# Altium project Metlino.PrjPcb (part 12 of 13)

## Sheet MCH_FPGA_Banks_66_68_HP_FMC.SchDoc: Metlino
size 420 x 297 mm; CheckedBy: P.Kulik,T.Przywozki,W.Ruclo; Author: G.Kasprowicz; CompanyName: WUT ISE; DrawnBy: G.Kasprowicz; Organization: WUT ISE; Address1: PW ISE; Address2: Nowowiejska 15/19 00-665 Warsaw; Address3: gkasprow@gmail.com; DocumentNumber: 5; Revision: 2; SheetNumber: 5; SheetTotal: 29; ModifiedBy: -; CheckedDate: -; Title2: FPGA banks - FMC; DivGrp: WUT ISE; Designer: G.Kasprowicz; ModifiedDate: -; ProjectName: Sensor Box
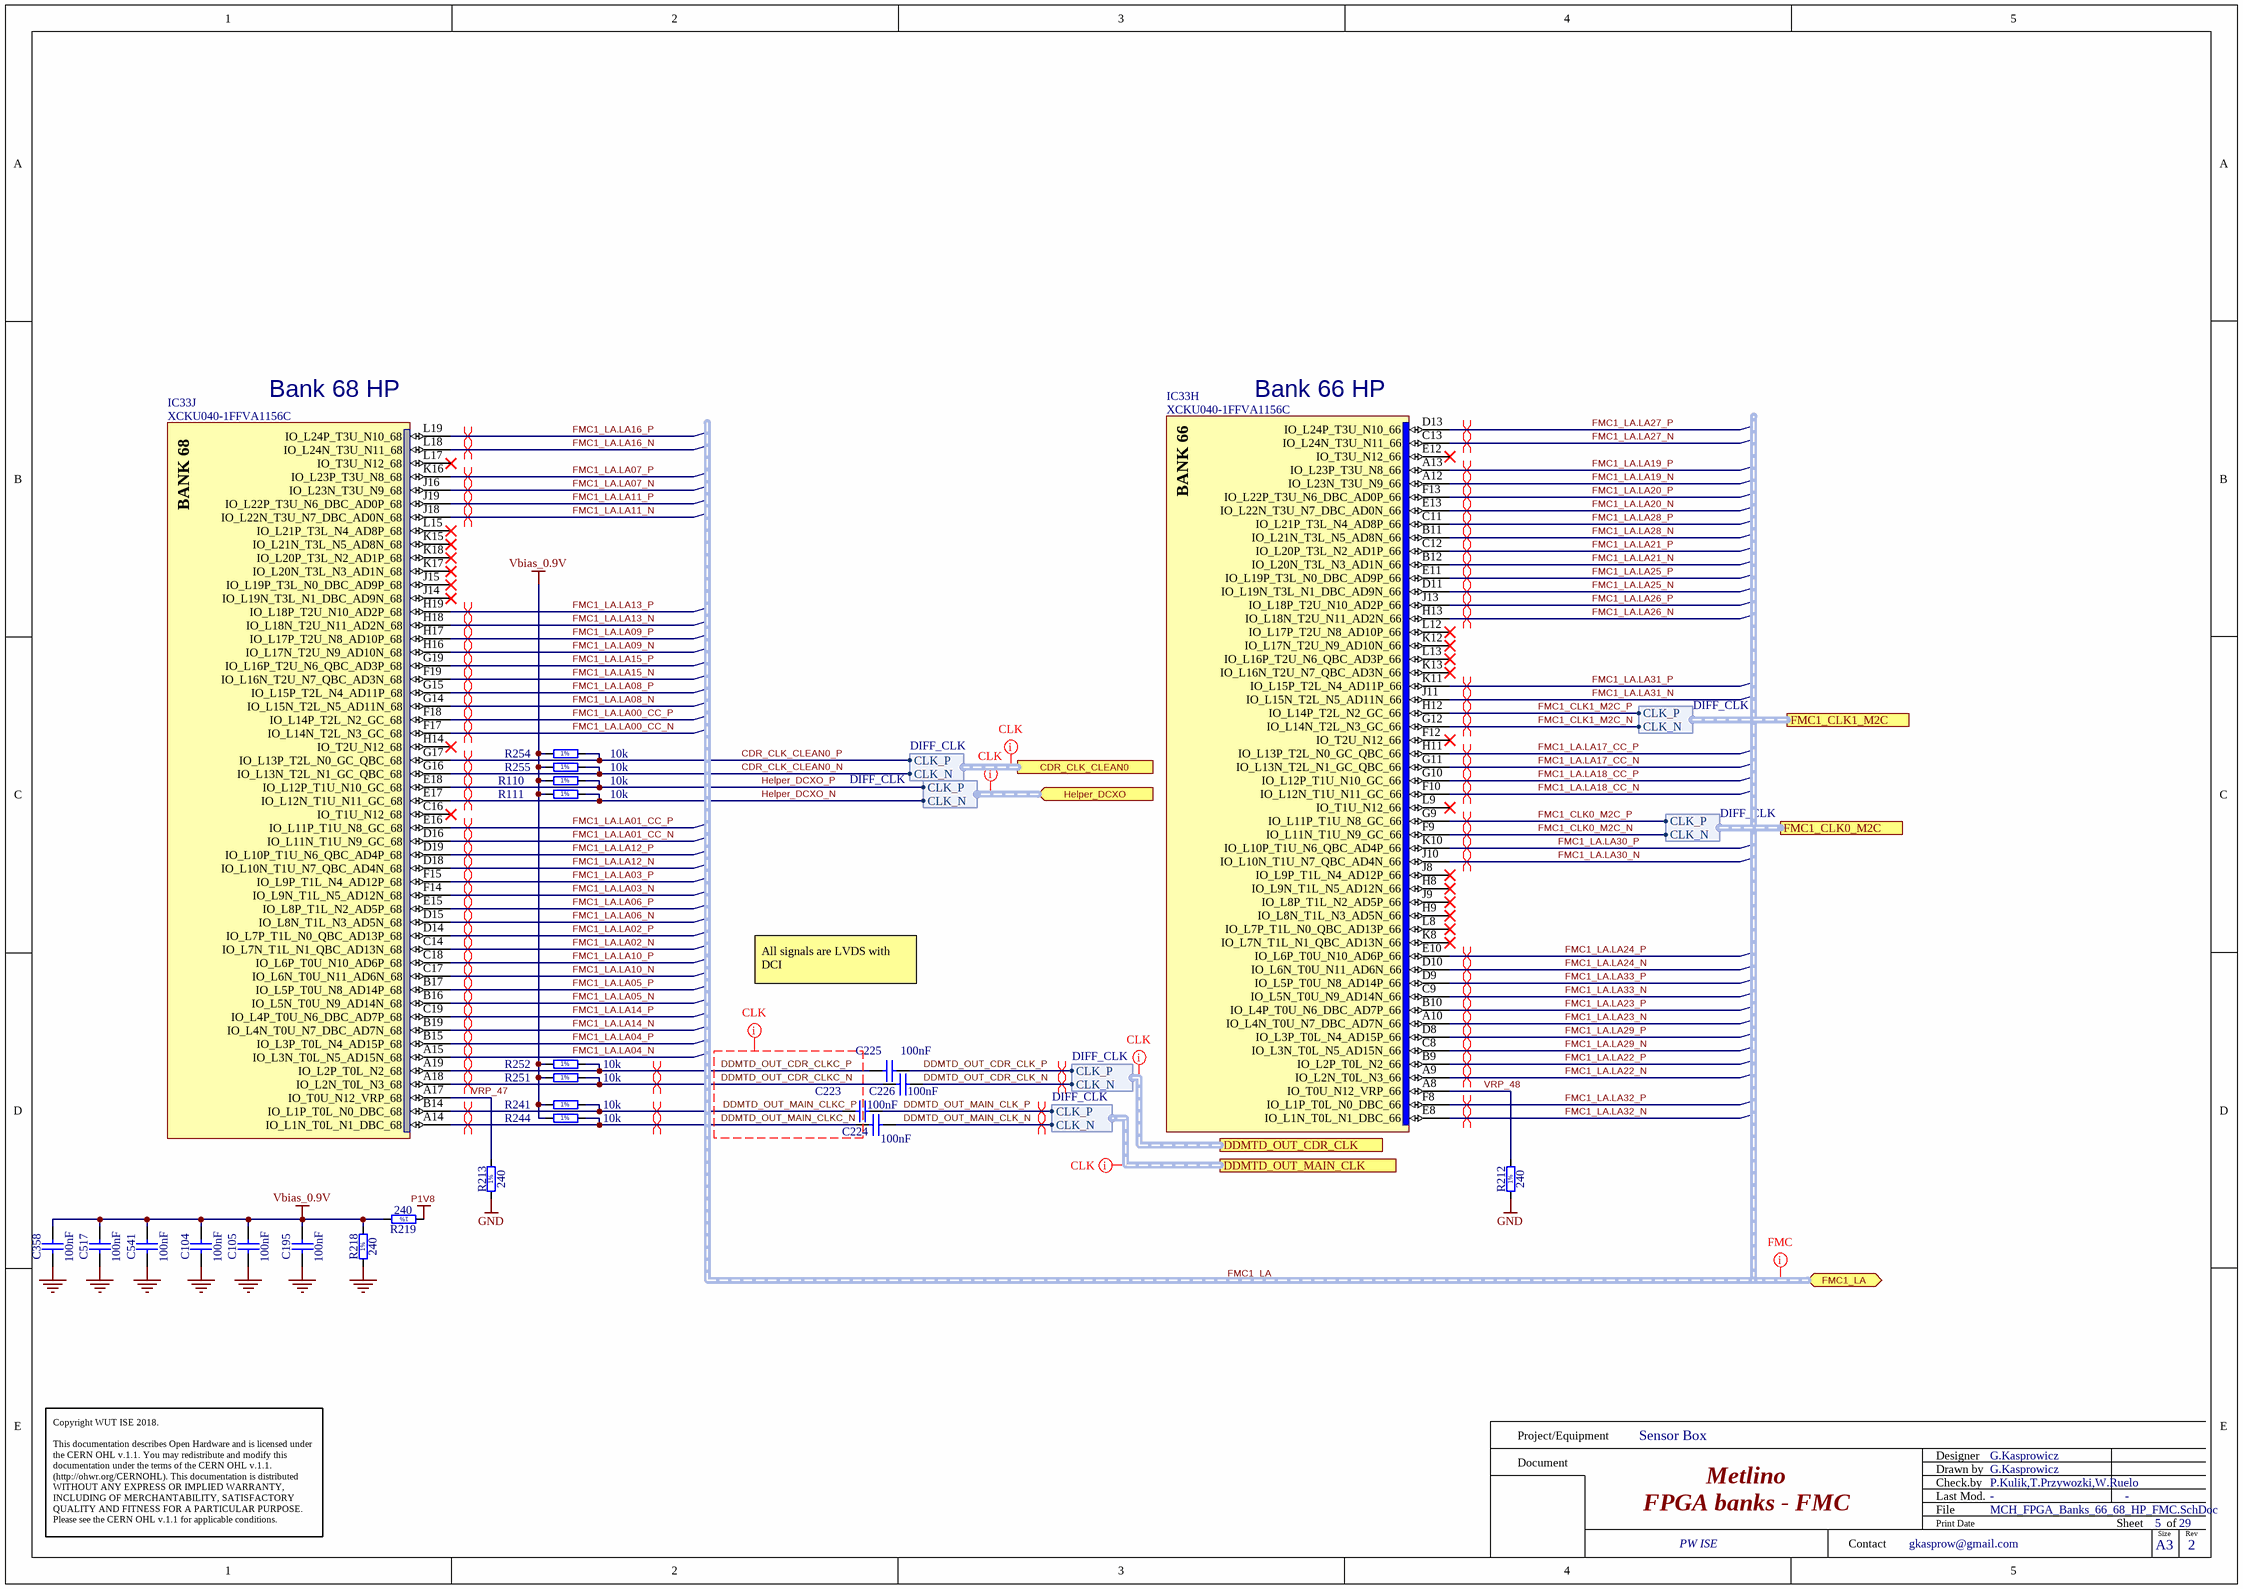
[diagram p25: MCH_FPGA_Banks_66_68_HP_FMC.SchDoc]

### Parts
C104  100nF  [CAPC0603X33N]
C105  100nF  [CAPC0603X33N]
C195  100nF  [CAPC0603X33N]
C223  100nF  [CAPC0603X33N]
C224  100nF  [CAPC0603X33N]
C225  100nF  [CAPC0603X33N]
C226  100nF  [CAPC0603X33N]
C358  100nF  [CAPC0603X33N]
C517  100nF  [CAPC0603X33N]
C541  100nF  [CAPC0603X33N]
IC33  XCKU040-1FFVA1156C  [BGA1156C100P34X34_3500X3500X350]  (parts H,J of 22)
R110  10k  [RESC1005X40N]
R111  10k  [RESC1005X40N]
R212  240  [RESC1005X40N]
R213  240  [RESC1005X40N]
R218  240  [RESC1005X40N]
R219  240  [RESC1005X40N]
R241  10k  [RESC1005X40N]
R244  10k  [RESC1005X40N]
R251  10k  [RESC1005X40N]
R252  10k  [RESC1005X40N]
R254  10k  [RESC1005X40N]
R255  10k  [RESC1005X40N]

### Ports
CDR_CLK_CLEAN0 (harness DIFF_CLK), DDMTD_OUT_CDR_CLK (harness DIFF_CLK), DDMTD_OUT_MAIN_CLK (harness DIFF_CLK), FMC1_CLK0_M2C (harness DIFF_CLK), FMC1_CLK1_M2C (harness DIFF_CLK), FMC1_LA (bidir, harness FMC_LA), Helper_DCXO (in, harness DIFF_CLK)

### Harnesses
DIFF_CLK: CLK_N, CLK_P

### Nets
GND: C104.2 C105.2 C195.2 C358.2 C517.2 C541.2 R212.1 R213.1 R218.1
P1V8: R219.1
Vbias_0.9V: C104.1 C105.1 C195.1 C358.1 C517.1 C541.1 R110.1 R111.1 R218.2 R219.2 R241.1 R244.1 R251.1 R252.1 R254.1 R255.1
CDR_CLK_CLEAN0_N: IC33.G16(IO_L13N_T2L_N1_GC_QBC_68) R255.2 ; port CDR_CLK_CLEAN0.CLK_N
CDR_CLK_CLEAN0_P: IC33.G17(IO_L13P_T2L_N0_GC_QBC_68) R254.2 ; port CDR_CLK_CLEAN0.CLK_P
DDMTD_OUT_CDR_CLK_N: C226.2 ; port DDMTD_OUT_CDR_CLK.CLK_N
DDMTD_OUT_CDR_CLK_P: C225.2 ; port DDMTD_OUT_CDR_CLK.CLK_P
DDMTD_OUT_CDR_CLKC_N: C226.1 IC33.A18(IO_L2N_T0L_N3_68) R251.2
DDMTD_OUT_CDR_CLKC_P: C225.1 IC33.A19(IO_L2P_T0L_N2_68) R252.2
DDMTD_OUT_MAIN_CLK_N: C224.2 ; port DDMTD_OUT_MAIN_CLK.CLK_N
DDMTD_OUT_MAIN_CLK_P: C223.2 ; port DDMTD_OUT_MAIN_CLK.CLK_P
DDMTD_OUT_MAIN_CLKC_N: C224.1 IC33.A14(IO_L1N_T0L_N1_DBC_68) R244.2
DDMTD_OUT_MAIN_CLKC_P: C223.1 IC33.B14(IO_L1P_T0L_N0_DBC_68) R241.2
FMC1_CLK0_M2C_N: IC33.F9(IO_L11N_T1U_N9_GC_66) ; port FMC1_CLK0_M2C.CLK_N  [project net CLK0_M2C_N]
FMC1_CLK0_M2C_P: IC33.G9(IO_L11P_T1U_N8_GC_66) ; port FMC1_CLK0_M2C.CLK_P  [project net CLK0_M2C_P]
FMC1_CLK1_M2C_N: IC33.G12(IO_L14N_T2L_N3_GC_66) ; port FMC1_CLK1_M2C.CLK_N  [project net CLK1_M2C_N]
FMC1_CLK1_M2C_P: IC33.H12(IO_L14P_T2L_N2_GC_66) ; port FMC1_CLK1_M2C.CLK_P  [project net CLK1_M2C_P]
FMC1_LA.LA00_CC_N: IC33.F17(IO_L14N_T2L_N3_GC_68)
FMC1_LA.LA00_CC_P: IC33.F18(IO_L14P_T2L_N2_GC_68)
FMC1_LA.LA01_CC_N: IC33.D16(IO_L11N_T1U_N9_GC_68)
FMC1_LA.LA01_CC_P: IC33.E16(IO_L11P_T1U_N8_GC_68)
FMC1_LA.LA02_N: IC33.C14(IO_L7N_T1L_N1_QBC_AD13N_68)
FMC1_LA.LA02_P: IC33.D14(IO_L7P_T1L_N0_QBC_AD13P_68)
FMC1_LA.LA03_N: IC33.F14(IO_L9N_T1L_N5_AD12N_68)
FMC1_LA.LA03_P: IC33.F15(IO_L9P_T1L_N4_AD12P_68)
FMC1_LA.LA04_N: IC33.A15(IO_L3N_T0L_N5_AD15N_68)
FMC1_LA.LA04_P: IC33.B15(IO_L3P_T0L_N4_AD15P_68)
FMC1_LA.LA05_N: IC33.B16(IO_L5N_T0U_N9_AD14N_68)
FMC1_LA.LA05_P: IC33.B17(IO_L5P_T0U_N8_AD14P_68)
FMC1_LA.LA06_N: IC33.D15(IO_L8N_T1L_N3_AD5N_68)
FMC1_LA.LA06_P: IC33.E15(IO_L8P_T1L_N2_AD5P_68)
FMC1_LA.LA07_N: IC33.J16(IO_L23N_T3U_N9_68)
FMC1_LA.LA07_P: IC33.K16(IO_L23P_T3U_N8_68)
FMC1_LA.LA08_N: IC33.G14(IO_L15N_T2L_N5_AD11N_68)
FMC1_LA.LA08_P: IC33.G15(IO_L15P_T2L_N4_AD11P_68)
FMC1_LA.LA09_N: IC33.H16(IO_L17N_T2U_N9_AD10N_68)
FMC1_LA.LA09_P: IC33.H17(IO_L17P_T2U_N8_AD10P_68)
FMC1_LA.LA10_N: IC33.C17(IO_L6N_T0U_N11_AD6N_68)
FMC1_LA.LA10_P: IC33.C18(IO_L6P_T0U_N10_AD6P_68)
FMC1_LA.LA11_N: IC33.J18(IO_L22N_T3U_N7_DBC_AD0N_68)
FMC1_LA.LA11_P: IC33.J19(IO_L22P_T3U_N6_DBC_AD0P_68)
FMC1_LA.LA12_N: IC33.D18(IO_L10N_T1U_N7_QBC_AD4N_68)
FMC1_LA.LA12_P: IC33.D19(IO_L10P_T1U_N6_QBC_AD4P_68)
FMC1_LA.LA13_N: IC33.H18(IO_L18N_T2U_N11_AD2N_68)
FMC1_LA.LA13_P: IC33.H19(IO_L18P_T2U_N10_AD2P_68)
FMC1_LA.LA14_N: IC33.B19(IO_L4N_T0U_N7_DBC_AD7N_68)
FMC1_LA.LA14_P: IC33.C19(IO_L4P_T0U_N6_DBC_AD7P_68)
FMC1_LA.LA15_N: IC33.F19(IO_L16N_T2U_N7_QBC_AD3N_68)
FMC1_LA.LA15_P: IC33.G19(IO_L16P_T2U_N6_QBC_AD3P_68)
FMC1_LA.LA16_N: IC33.L18(IO_L24N_T3U_N11_68)
FMC1_LA.LA16_P: IC33.L19(IO_L24P_T3U_N10_68)
FMC1_LA.LA17_CC_N: IC33.G11(IO_L13N_T2L_N1_GC_QBC_66)
FMC1_LA.LA17_CC_P: IC33.H11(IO_L13P_T2L_N0_GC_QBC_66)
FMC1_LA.LA18_CC_N: IC33.F10(IO_L12N_T1U_N11_GC_66)
FMC1_LA.LA18_CC_P: IC33.G10(IO_L12P_T1U_N10_GC_66)
FMC1_LA.LA19_N: IC33.A12(IO_L23N_T3U_N9_66)
FMC1_LA.LA19_P: IC33.A13(IO_L23P_T3U_N8_66)
FMC1_LA.LA20_N: IC33.E13(IO_L22N_T3U_N7_DBC_AD0N_66)
FMC1_LA.LA20_P: IC33.F13(IO_L22P_T3U_N6_DBC_AD0P_66)
FMC1_LA.LA21_N: IC33.B12(IO_L20N_T3L_N3_AD1N_66)
FMC1_LA.LA21_P: IC33.C12(IO_L20P_T3L_N2_AD1P_66)
FMC1_LA.LA22_N: IC33.A9(IO_L2N_T0L_N3_66)
FMC1_LA.LA22_P: IC33.B9(IO_L2P_T0L_N2_66)
FMC1_LA.LA23_N: IC33.A10(IO_L4N_T0U_N7_DBC_AD7N_66)
FMC1_LA.LA23_P: IC33.B10(IO_L4P_T0U_N6_DBC_AD7P_66)
FMC1_LA.LA24_N: IC33.D10(IO_L6N_T0U_N11_AD6N_66)
FMC1_LA.LA24_P: IC33.E10(IO_L6P_T0U_N10_AD6P_66)
FMC1_LA.LA25_N: IC33.D11(IO_L19N_T3L_N1_DBC_AD9N_66)
FMC1_LA.LA25_P: IC33.E11(IO_L19P_T3L_N0_DBC_AD9P_66)
FMC1_LA.LA26_N: IC33.H13(IO_L18N_T2U_N11_AD2N_66)
FMC1_LA.LA26_P: IC33.J13(IO_L18P_T2U_N10_AD2P_66)
FMC1_LA.LA27_N: IC33.C13(IO_L24N_T3U_N11_66)
FMC1_LA.LA27_P: IC33.D13(IO_L24P_T3U_N10_66)
FMC1_LA.LA28_N: IC33.B11(IO_L21N_T3L_N5_AD8N_66)
FMC1_LA.LA28_P: IC33.C11(IO_L21P_T3L_N4_AD8P_66)
FMC1_LA.LA29_N: IC33.C8(IO_L3N_T0L_N5_AD15N_66)
FMC1_LA.LA29_P: IC33.D8(IO_L3P_T0L_N4_AD15P_66)
FMC1_LA.LA30_N: IC33.J10(IO_L10N_T1U_N7_QBC_AD4N_66)
FMC1_LA.LA30_P: IC33.K10(IO_L10P_T1U_N6_QBC_AD4P_66)
FMC1_LA.LA31_N: IC33.J11(IO_L15N_T2L_N5_AD11N_66)
FMC1_LA.LA31_P: IC33.K11(IO_L15P_T2L_N4_AD11P_66)
FMC1_LA.LA32_N: IC33.E8(IO_L1N_T0L_N1_DBC_66)
FMC1_LA.LA32_P: IC33.F8(IO_L1P_T0L_N0_DBC_66)
FMC1_LA.LA33_N: IC33.C9(IO_L5N_T0U_N9_AD14N_66)
FMC1_LA.LA33_P: IC33.D9(IO_L5P_T0U_N8_AD14P_66)
Helper_DCXO_N: IC33.E17(IO_L12N_T1U_N11_GC_68) R111.2 ; port Helper_DCXO.CLK_N  [project net Helper_CLK_N]
Helper_DCXO_P: IC33.E18(IO_L12P_T1U_N10_GC_68) R110.2 ; port Helper_DCXO.CLK_P  [project net Helper_CLK_P]
VRP_47: IC33.A17(IO_T0U_N12_VRP_68) R213.2
VRP_48: IC33.A8(IO_T0U_N12_VRP_66) R212.2

Not connected (* = marked no-connect by the designer): IC33 C16(IO_T1U_N12_68)* E12(IO_T3U_N12_66)* F12(IO_T2U_N12_66)* H8(IO_L9N_T1L_N5_AD12N_66)* H9(IO_L8N_T1L_N3_AD5N_66)* H14(IO_T2U_N12_68)* J8(IO_L9P_T1L_N4_AD12P_66)* J9(IO_L8P_T1L_N2_AD5P_66)* J14(IO_L19N_T3L_N1_DBC_AD9N_68)* J15(IO_L19P_T3L_N0_DBC_AD9P_68)* K8(IO_L7N_T1L_N1_QBC_AD13N_66)* K12(IO_L17N_T2U_N9_AD10N_66)* K13(IO_L16N_T2U_N7_QBC_AD3N_66)* K15(IO_L21N_T3L_N5_AD8N_68)* K17(IO_L20N_T3L_N3_AD1N_68)* K18(IO_L20P_T3L_N2_AD1P_68)* L8(IO_L7P_T1L_N0_QBC_AD13P_66)* L9(IO_T1U_N12_66)* L12(IO_L17P_T2U_N8_AD10P_66)* L13(IO_L16P_T2U_N6_QBC_AD3P_66)* L15(IO_L21P_T3L_N4_AD8P_68)* L17(IO_T3U_N12_68)*

### Buses and harness runs
harness FMC1_LA = port FMC1_LA

### Layout directives
net class CLK: (no net found under the mark), DDMTD_OUT_CDR_CLKC_N, DDMTD_OUT_CDR_CLKC_P, DDMTD_OUT_MAIN_CLKC_N, DDMTD_OUT_MAIN_CLKC_P
differential pair: CDR_CLK_CLEAN0_N, CDR_CLK_CLEAN0_P, CLK0_M2C_N, CLK0_M2C_P, CLK1_M2C_N, CLK1_M2C_P, DDMTD_OUT_CDR_CLK_N, DDMTD_OUT_CDR_CLK_P, DDMTD_OUT_CDR_CLKC_N, DDMTD_OUT_CDR_CLKC_P, DDMTD_OUT_MAIN_CLK_N, DDMTD_OUT_MAIN_CLK_P, DDMTD_OUT_MAIN_CLKC_N, DDMTD_OUT_MAIN_CLKC_P, FMC1_LA.LA00_CC_N, FMC1_LA.LA00_CC_P, FMC1_LA.LA01_CC_N, FMC1_LA.LA01_CC_P, FMC1_LA.LA02_N, FMC1_LA.LA02_P, FMC1_LA.LA03_N, FMC1_LA.LA03_P, FMC1_LA.LA04_N, FMC1_LA.LA04_P, FMC1_LA.LA05_N, FMC1_LA.LA05_P, FMC1_LA.LA06_N, FMC1_LA.LA06_P, FMC1_LA.LA07_N, FMC1_LA.LA07_P, FMC1_LA.LA08_N, FMC1_LA.LA08_P, FMC1_LA.LA09_N, FMC1_LA.LA09_P, FMC1_LA.LA10_N, FMC1_LA.LA10_P, FMC1_LA.LA11_N, FMC1_LA.LA11_P, FMC1_LA.LA12_N, FMC1_LA.LA12_P, FMC1_LA.LA13_N, FMC1_LA.LA13_P, FMC1_LA.LA14_N, FMC1_LA.LA14_P, FMC1_LA.LA15_N, FMC1_LA.LA15_P, FMC1_LA.LA16_N, FMC1_LA.LA16_P, FMC1_LA.LA17_CC_N, FMC1_LA.LA17_CC_P, FMC1_LA.LA18_CC_N, FMC1_LA.LA18_CC_P, FMC1_LA.LA19_N, FMC1_LA.LA19_P, FMC1_LA.LA20_N, FMC1_LA.LA20_P, FMC1_LA.LA21_N, FMC1_LA.LA21_P, FMC1_LA.LA22_N, FMC1_LA.LA22_P, FMC1_LA.LA23_N, FMC1_LA.LA23_P, FMC1_LA.LA24_N, FMC1_LA.LA24_P, FMC1_LA.LA25_N, FMC1_LA.LA25_P, FMC1_LA.LA26_N, FMC1_LA.LA26_P, FMC1_LA.LA27_N, FMC1_LA.LA27_P, FMC1_LA.LA28_N, FMC1_LA.LA28_P, FMC1_LA.LA29_N, FMC1_LA.LA29_P, FMC1_LA.LA30_N, FMC1_LA.LA30_P, FMC1_LA.LA31_N, FMC1_LA.LA31_P, FMC1_LA.LA32_N, FMC1_LA.LA32_P, FMC1_LA.LA33_N, FMC1_LA.LA33_P, Helper_CLK_N, Helper_CLK_P
net class LVDS_FMC: (no net found under the mark)

### Notes on the sheet
- (near IC33) Bank 68 HP
- (near IC33) Bank 66 HP
- All signals are LVDS with DCI
- Project/Equipment
- Document
- Designer
- Drawn by
- Check.by
- Copyright WUT ISE 2018.
  This documentation describes Open Hardware and is licensed under the CERN OHL v.1.1. You may redistribute and modify this documentation under the terms of the CERN OHL v.1.1. (http://ohwr.org/CERNOHL). This documentation is distributed WITHOUT ANY EXPRESS OR IMPLIED WARRANTY, INCLUDING OF MERCHANTABILITY, SATISFACTORY QUALITY AND FITNESS FOR A PARTICULAR PURPOSE. Please see the CERN OHL v.1.1 for applicable conditions.
- Contact
- File
- Last Mod.
- Print Date
- Sheet
- Size
- A3
- of
- Rev
- (in symbol R0402_10K_1%_0.0625W_100PPM) 1%
- (in symbol R0402_240R_1%_0.0625W_100PPM) 1%
- (in symbol XCKU040-1FFVA1156C, part H) BANK 66
- (in symbol XCKU040-1FFVA1156C, part J) BANK 68

### Library data of the parts
C104 C105 C195 C223-C226 C358 C517 C541 = CC0201_100NF_6.3V_10%_X5R: Non-polarised capacitor; Manufacturer: GENERIC; Part Description: SMD Multilayer Chip Ceramic Capacitor; Manufacturer1 Part Number: 02016D104KAT2A; Tolerance: ±10%; Voltage: 6.3V; TC: X5R; Manufacturer Part Number: CC0201_100NF_6.3V_10%_X5R; Part Number: CC0201_100NF_6.3V_10%_X5R; Value: 100nF; Component Kind: Standard; Component Type: Standard; Pin Count: 2; Status: Not Recommended; Case: 0201; Mounted: Yes; Socket: No; SMD: Yes; Sense: No; Manufacturer1 Example: AVX; Manufacturer1 ComponentHeight: 0.33mm; HelpURL: \\cern.ch\dfs\Applications\Altium\Datasheets\CC0201_X5R_AVX.pdf; Author: CERN DEM JLC; CreateDate: 03.12.2007; LatestRevisionDate: 03.12.2007
IC33 = XCKU040-1FFVA1156C: Kintex UltraScale FPGA, 520 I/O, 530K Cells, 1156-Ball BGA, Speed Grade 1, Commercial Grade; Manufacturer: XILINX; Part Description: Kintex UltraScale, 40 DLL I/O, 416 HP I/O, 104 HR I/O, 1156-Pin BGA, Speed Grade 1, Commercial Grade; PressFit: No; Bonding: No; PackageDescription: BGA, 1.00mm Pitch, Square; 1156 Pin, 34 Columns X 34 Rows, Body 35.00mm X 35.00mm X 3.50mm H, IPC Medium Density; Part Number: XCKU040-1FFVA1156C; Component Kind: Standard; Component Type: Standard; Device: XCKU040-1FFVA1156C; Manufacturer Part Number: XCKU040-1FFVA1156C; Pin Count: 1156; Case: BGA1156; Mounted: Yes; Socket: No; SMD: Yes; Sense: No; ComponentHeight: 3.5mm; HelpURL: \\cern.ch\dfs\Applications\Altium\Datasheets\XCKU040-1FFVA1156C.pdf; ComponentLink1URL: \\cern.ch\dfs\Applications\Altium\Datasheets\XCKU040-1FFVA1156C_Package-Pinout.pdf; ComponentLink1Description: Package/Pinout; Author: CERN DEM CA; CreateDate: 16.08.2016; LatestRevisionDate: 16.08.2016
R110 R111 R241 R244 R251 R252 R254 R255 = R0402_10K_1%_0.0625W_100PPM: Resistor - 1%; Manufacturer: GENERIC; Part Description: General Purpose Thick Film Chip Resistor; Manufacturer1 Part Number: 232270671003L; TC: ±100ppm/°C; PressFit: No; Manufacturer Part Number: R0402_10K_1%_0.0625W_100PPM; Part Number: R0402_10K_1%_0.0625W_100PPM; Tolerance: ±1%; Value: 10k; Component Kind: Standard; Component Type: Standard; Pin Count: 2; Status: Not Recommended; Power: 0.0625W; Case: 0402; Mounted: Yes; Sense: No; Socket: No; SMD: Yes; Manufacturer1 Example: YAGEO PHYCOMP; Manufacturer1 ComponentHeight: 0.4mm; HelpURL: \\cern.ch\dfs\Applications\Altium\Datasheets\R0402_Phycomp_RC0402.pdf; Author: CERN DEM JLC; CreateDate: 03.12.2007; LatestRevisionDate: 17.10.2012
R212 R213 R218 R219 = R0402_240R_1%_0.0625W_100PPM: Resistor - 1%; Manufacturer: GENERIC; Part Description: General Purpose Thick Film Chip Resistor; Manufacturer1 Part Number: 232270672401L; TC: ±100ppm/°C; PressFit: No; Manufacturer Part Number: R0402_240R_1%_0.0625W_100PPM; Part Number: R0402_240R_1%_0.0625W_100PPM; Tolerance: ±1%; Value: 240; Component Kind: Standard; Component Type: Standard; Pin Count: 2; Status: Not Recommended; Power: 0.0625W; Case: 0402; Mounted: Yes; Sense: No; Socket: No; SMD: Yes; Manufacturer1 Example: YAGEO PHYCOMP; Manufacturer1 ComponentHeight: 0.4mm; HelpURL: \\cern.ch\dfs\Applications\Altium\Datasheets\R0402_Phycomp_RC0402.pdf; Author: CERN DEM JLC; CreateDate: 03.12.2007; LatestRevisionDate: 17.10.2012

## Sheet MCH_FPGA_Power.SchDoc: Metlino
size 420 x 297 mm; CheckedBy: P.Kulik,T.Przywozki,W.Ruclo; Author: G.Kasprowicz; CompanyName: WUT ISE; DrawnBy: G.Kasprowicz; Organization: WUT ISE; Address1: PW ISE; Address2: Nowowiejska 15/19 00-665 Warsaw; Address3: gkasprow@gmail.com; DocumentNumber: 9; Revision: 2; SheetNumber: 9; SheetTotal: 29; ModifiedBy: -; CheckedDate: -; Title2: FPGA power rails; DivGrp: WUT ISE; Designer: G.Kasprowicz; ModifiedDate: -; ProjectName: Sensor Box
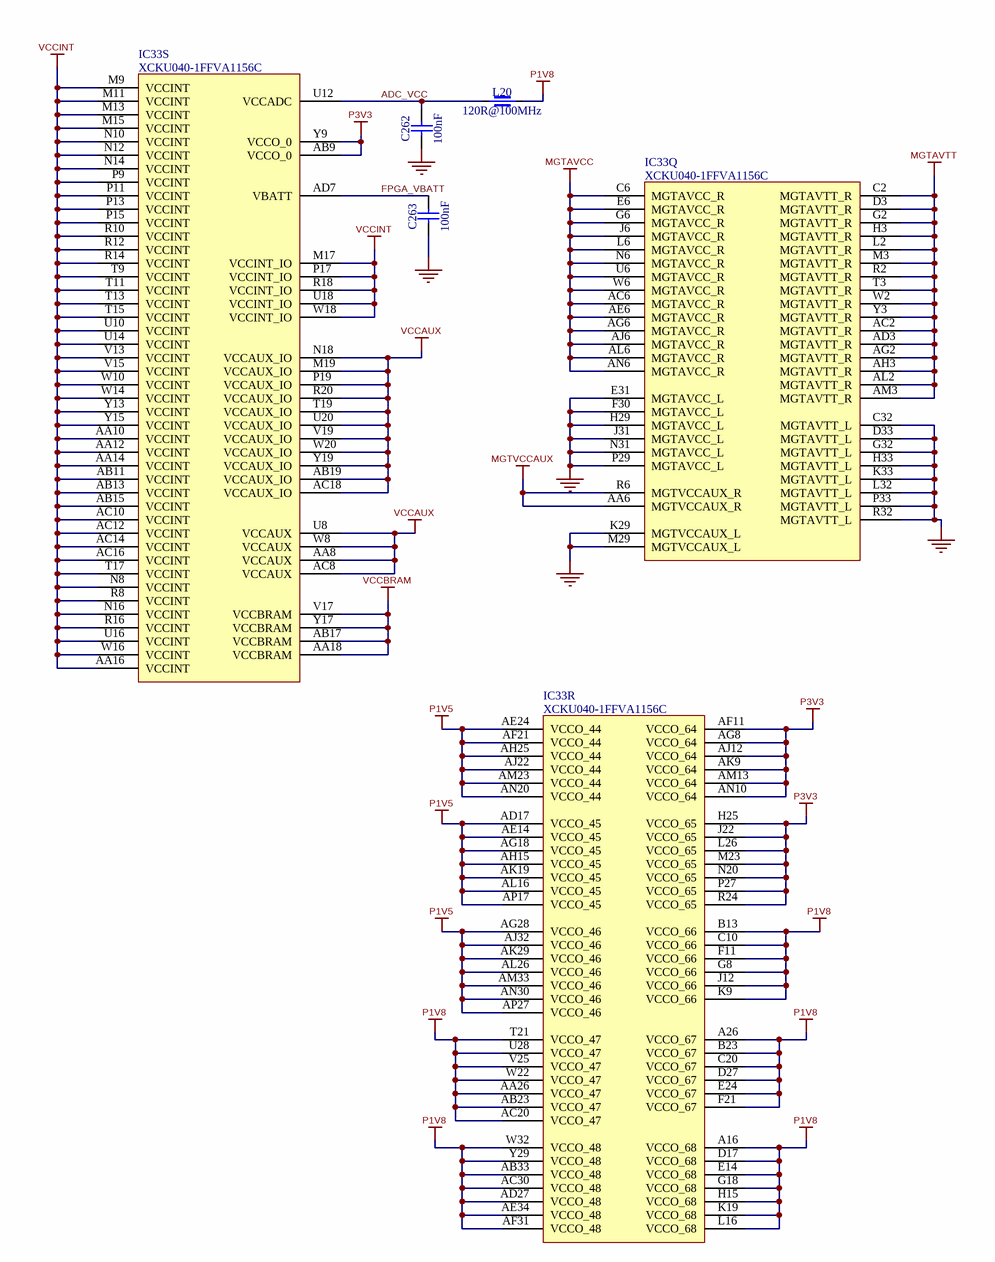
[diagram p26: MCH_FPGA_Power.SchDoc]

### Parts
C262  100nF  [CAPC0603X33N]
C263  100nF  [CAPC0603X33N]
IC33  XCKU040-1FFVA1156C  [BGA1156C100P34X34_3500X3500X350]  (parts Q,R,S of 22)
L20  120R@100MHz  [INDC1005X55N]

### Nets
GND: C262.1 C263.1 IC33.C32(MGTAVTT_L) IC33.D33(MGTAVTT_L) IC33.E31(MGTAVCC_L) IC33.F30(MGTAVCC_L) IC33.G32(MGTAVTT_L) IC33.H29(MGTAVCC_L) IC33.H33(MGTAVTT_L) IC33.J31(MGTAVCC_L) IC33.K29(MGTVCCAUX_L) IC33.K33(MGTAVTT_L) IC33.L32(MGTAVTT_L) IC33.M29(MGTVCCAUX_L) IC33.N31(MGTAVCC_L) IC33.P29(MGTAVCC_L) IC33.P33(MGTAVTT_L) IC33.R32(MGTAVTT_L)
MGTAVCC: IC33.AC6(MGTAVCC_R) IC33.AE6(MGTAVCC_R) IC33.AG6(MGTAVCC_R) IC33.AJ6(MGTAVCC_R) IC33.AL6(MGTAVCC_R) IC33.AN6(MGTAVCC_R) IC33.C6(MGTAVCC_R) IC33.E6(MGTAVCC_R) IC33.G6(MGTAVCC_R) IC33.J6(MGTAVCC_R) IC33.L6(MGTAVCC_R) IC33.N6(MGTAVCC_R) IC33.U6(MGTAVCC_R) IC33.W6(MGTAVCC_R)
MGTAVTT: IC33.AC2(MGTAVTT_R) IC33.AD3(MGTAVTT_R) IC33.AG2(MGTAVTT_R) IC33.AH3(MGTAVTT_R) IC33.AL2(MGTAVTT_R) IC33.AM3(MGTAVTT_R) IC33.C2(MGTAVTT_R) IC33.D3(MGTAVTT_R) IC33.G2(MGTAVTT_R) IC33.H3(MGTAVTT_R) IC33.L2(MGTAVTT_R) IC33.M3(MGTAVTT_R) IC33.R2(MGTAVTT_R) IC33.T3(MGTAVTT_R) IC33.W2(MGTAVTT_R) IC33.Y3(MGTAVTT_R)
MGTVCCAUX: IC33.AA6(MGTVCCAUX_R) IC33.R6(MGTVCCAUX_R)
P1V5: IC33.AD17(VCCO_45) IC33.AE14(VCCO_45) IC33.AE24(VCCO_44) IC33.AF21(VCCO_44) IC33.AG18(VCCO_45) IC33.AG28(VCCO_46) IC33.AH15(VCCO_45) IC33.AH25(VCCO_44) IC33.AJ22(VCCO_44) IC33.AJ32(VCCO_46) IC33.AK19(VCCO_45) IC33.AK29(VCCO_46) IC33.AL16(VCCO_45) IC33.AL26(VCCO_46) IC33.AM23(VCCO_44) IC33.AM33(VCCO_46) IC33.AN20(VCCO_44) IC33.AN30(VCCO_46) IC33.AP17(VCCO_45) IC33.AP27(VCCO_46)
P1V8: IC33.A16(VCCO_68) IC33.A26(VCCO_67) IC33.AA26(VCCO_47) IC33.AB23(VCCO_47) IC33.AB33(VCCO_48) IC33.AC20(VCCO_47) IC33.AC30(VCCO_48) IC33.AD27(VCCO_48) IC33.AE34(VCCO_48) IC33.AF31(VCCO_48) IC33.B13(VCCO_66) IC33.B23(VCCO_67) IC33.C10(VCCO_66) IC33.C20(VCCO_67) IC33.D17(VCCO_68) IC33.D27(VCCO_67) IC33.E14(VCCO_68) IC33.E24(VCCO_67) IC33.F11(VCCO_66) IC33.F21(VCCO_67) IC33.G8(VCCO_66) IC33.G18(VCCO_68) IC33.H15(VCCO_68) IC33.J12(VCCO_66) IC33.K9(VCCO_66) IC33.K19(VCCO_68) IC33.L16(VCCO_68) IC33.T21(VCCO_47) IC33.U28(VCCO_47) IC33.V25(VCCO_47) IC33.W22(VCCO_47) IC33.W32(VCCO_48) IC33.Y29(VCCO_48) L20.2
P3V3: IC33.AB9(VCCO_0) IC33.AF11(VCCO_64) IC33.AG8(VCCO_64) IC33.AJ12(VCCO_64) IC33.AK9(VCCO_64) IC33.AM13(VCCO_64) IC33.AN10(VCCO_64) IC33.H25(VCCO_65) IC33.J22(VCCO_65) IC33.L26(VCCO_65) IC33.M23(VCCO_65) IC33.N20(VCCO_65) IC33.P27(VCCO_65) IC33.R24(VCCO_65) IC33.Y9(VCCO_0)
VCCAUX: IC33.AA8(VCCAUX) IC33.AB19(VCCAUX_IO) IC33.AC8(VCCAUX) IC33.AC18(VCCAUX_IO) IC33.M19(VCCAUX_IO) IC33.N18(VCCAUX_IO) IC33.P19(VCCAUX_IO) IC33.R20(VCCAUX_IO) IC33.T19(VCCAUX_IO) IC33.U8(VCCAUX) IC33.U20(VCCAUX_IO) IC33.V19(VCCAUX_IO) IC33.W8(VCCAUX) IC33.W20(VCCAUX_IO) IC33.Y19(VCCAUX_IO)
VCCBRAM: IC33.AA18(VCCBRAM) IC33.AB17(VCCBRAM) IC33.V17(VCCBRAM) IC33.Y17(VCCBRAM)
VCCINT: IC33.AA10(VCCINT) IC33.AA12(VCCINT) IC33.AA14(VCCINT) IC33.AA16(VCCINT) IC33.AB11(VCCINT) IC33.AB13(VCCINT) IC33.AB15(VCCINT) IC33.AC10(VCCINT) IC33.AC12(VCCINT) IC33.AC14(VCCINT) IC33.AC16(VCCINT) IC33.M9(VCCINT) IC33.M11(VCCINT) IC33.M13(VCCINT) IC33.M15(VCCINT) IC33.M17(VCCINT_IO) IC33.N8(VCCINT) IC33.N10(VCCINT) IC33.N12(VCCINT) IC33.N14(VCCINT) IC33.N16(VCCINT) IC33.P9(VCCINT) IC33.P11(VCCINT) IC33.P13(VCCINT) IC33.P15(VCCINT) IC33.P17(VCCINT_IO) IC33.R8(VCCINT) IC33.R10(VCCINT) IC33.R12(VCCINT) IC33.R14(VCCINT) IC33.R16(VCCINT) IC33.R18(VCCINT_IO) IC33.T9(VCCINT) IC33.T11(VCCINT) IC33.T13(VCCINT) IC33.T15(VCCINT) IC33.T17(VCCINT) IC33.U10(VCCINT) IC33.U14(VCCINT) IC33.U16(VCCINT) IC33.U18(VCCINT_IO) IC33.V13(VCCINT) IC33.V15(VCCINT) IC33.W10(VCCINT) IC33.W14(VCCINT) IC33.W16(VCCINT) IC33.W18(VCCINT_IO) IC33.Y13(VCCINT) IC33.Y15(VCCINT)
ADC_VCC: C262.2 IC33.U12(VCCADC) L20.1
FPGA_VBATT: C263.2 IC33.AD7(VBATT)

### Notes on the sheet
- Project/Equipment
- Document
- Designer
- Drawn by
- Check.by
- Copyright WUT ISE 2018.
  This documentation describes Open Hardware and is licensed under the CERN OHL v.1.1. You may redistribute and modify this documentation under the terms of the CERN OHL v.1.1. (http://ohwr.org/CERNOHL). This documentation is distributed WITHOUT ANY EXPRESS OR IMPLIED WARRANTY, INCLUDING OF MERCHANTABILITY, SATISFACTORY QUALITY AND FITNESS FOR A PARTICULAR PURPOSE. Please see the CERN OHL v.1.1 for applicable conditions.
- Contact
- File
- Last Mod.
- Print Date
- Sheet
- Size
- A3
- of
- Rev

### Library data of the parts
C262 C263 = CC0201_100NF_6.3V_10%_X5R: as C104 on sheet MCH_FPGA_Banks_66_68_HP_FMC; Manufacturer Part Number: CC0201_100NF_6.3V_10%_X5R; Part Number: CC0201_100NF_6.3V_10%_X5R; Value: 100nF; Component Kind: Standard; Component Type: Standard; Pin Count: 2; Status: Not Recommended; Case: 0201; Mounted: Yes; Socket: No; SMD: Yes; Sense: No; Manufacturer1 Example: AVX; Manufacturer1 ComponentHeight: 0.33mm; HelpURL: \\cern.ch\dfs\Applications\Altium\Datasheets\CC0201_X5R_AVX.pdf; Author: CERN DEM JLC; CreateDate: 03.12.2007; LatestRevisionDate: 03.12.2007
IC33 = XCKU040-1FFVA1156C: as IC33 on sheet MCH_FPGA_Banks_66_68_HP_FMC; PackageDescription: BGA, 1.00mm Pitch, Square; 1156 Pin, 34 Columns X 34 Rows, Body 35.00mm X 35.00mm X 3.50mm H, IPC Medium Density; Part Number: XCKU040-1FFVA1156C; Component Kind: Standard; Component Type: Standard; Device: XCKU040-1FFVA1156C; Manufacturer Part Number: XCKU040-1FFVA1156C; Pin Count: 1156; Case: BGA1156; Mounted: Yes; Socket: No; SMD: Yes; Sense: No; ComponentHeight: 3.5mm; HelpURL: \\cern.ch\dfs\Applications\Altium\Datasheets\XCKU040-1FFVA1156C.pdf; ComponentLink1URL: \\cern.ch\dfs\Applications\Altium\Datasheets\XCKU040-1FFVA1156C_Package-Pinout.pdf; ComponentLink1Description: Package/Pinout; Author: CERN DEM CA; CreateDate: 16.08.2016; LatestRevisionDate: 16.08.2016
L20 = IND0402_MURATA_BLM15PX121SN1D: Manufacturer: MURATA; Part Description: SMD EMIFIL Chip Ferrite Bead; Tolerance: ±25%; Power: 2A; Resistance: 0.055R; Manufacturer Part Number: BLM15PX121SN1D; Part Number: IND0402_MURATA_BLM15PX121SN1D; Value: 120R@100MHz; Component Kind: Standard; Component Type: Standard; Pin Count: 2; Status: None; Case: 0402; Mounted: Yes; Socket: No; SMD: Yes; Sense: No; ComponentHeight: 0.55mm; HelpURL: \\cern.ch\dfs\Applications\Altium\Datasheets\IND0402_MURATA_BLM15PX.pdf; Author: CERN DEM JMW; CreateDate: 19.02.2014; LatestRevisionDate: 25.10.2018

## Sheet MCH_FPGA_GND_NC.SchDoc: Metlino
size 420 x 297 mm; CheckedBy: P.Kulik,T.Przywozki,W.Ruclo; Author: G.Kasprowicz; CompanyName: WUT ISE; DrawnBy: G.Kasprowicz; Organization: WUT ISE; Address1: PW ISE; Address2: Nowowiejska 15/19 00-665 Warsaw; Address3: gkasprow@gmail.com; DocumentNumber: 10; Revision: 2; SheetNumber: 10; SheetTotal: 29; ModifiedBy: -; CheckedDate: -; Title2: FPGA - GND & DNC pins; DivGrp: WUT ISE; Designer: G.Kasprowicz; ModifiedDate: -; ProjectName: Sensor Box
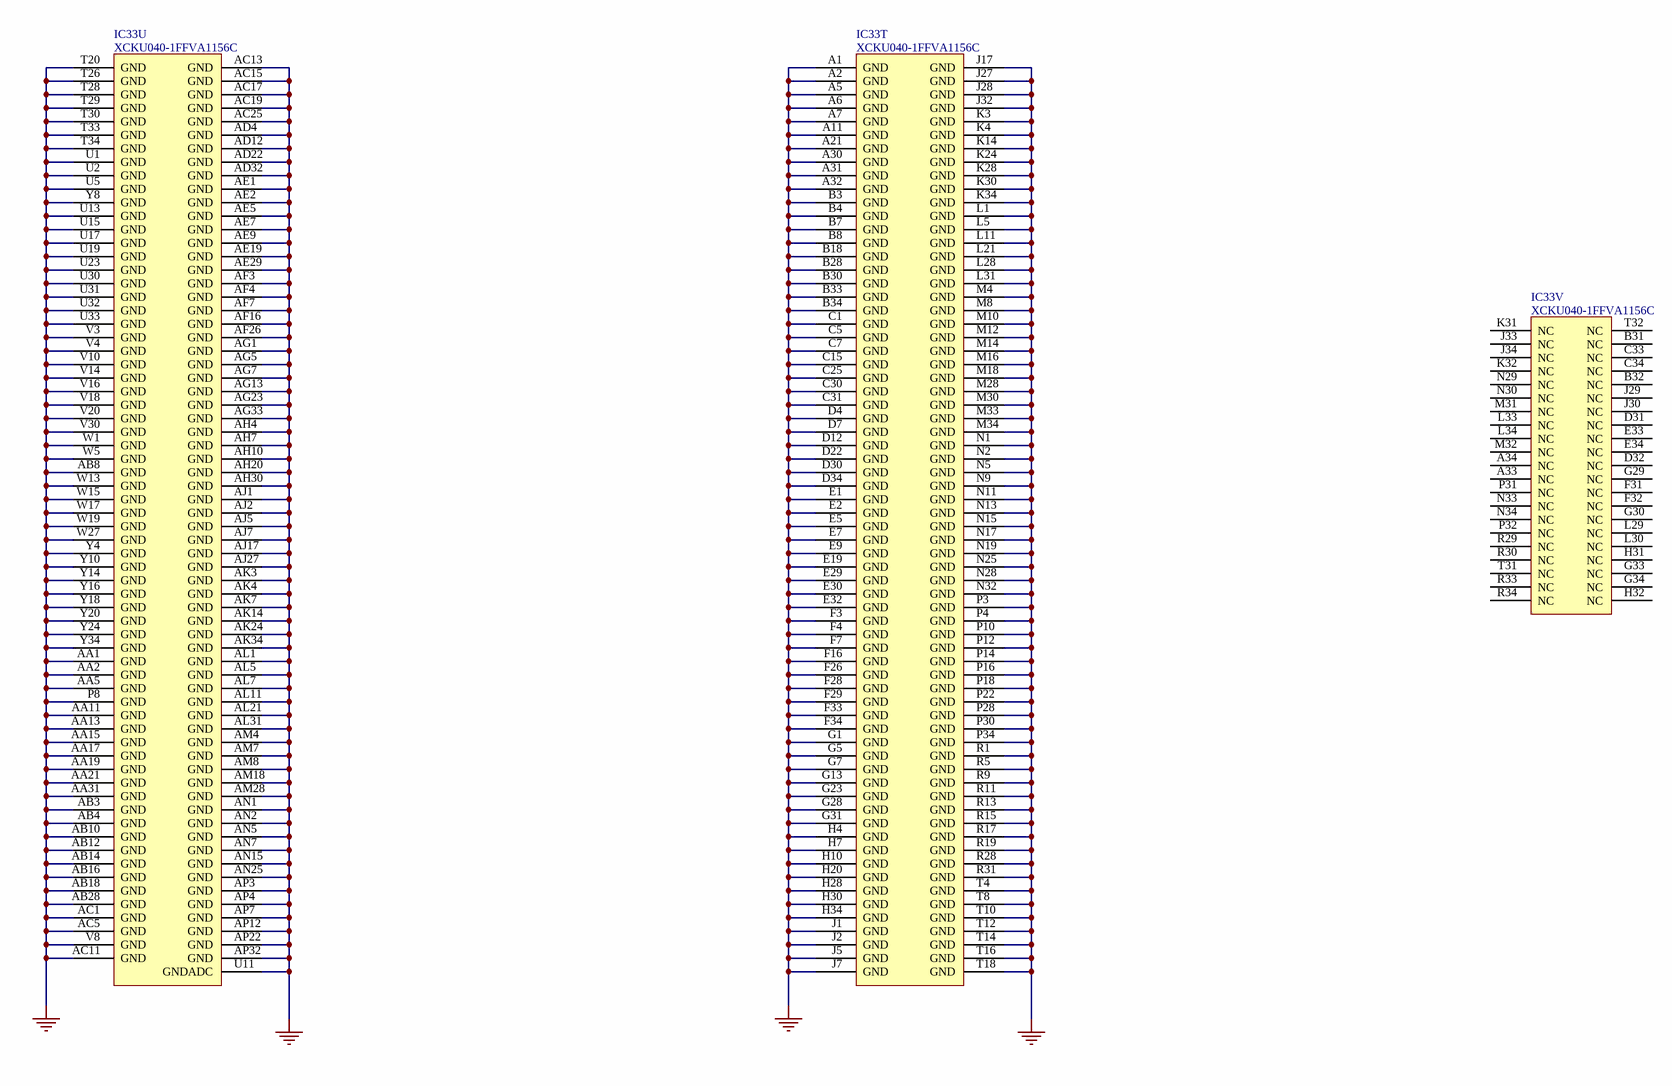
[diagram p27: MCH_FPGA_GND_NC.SchDoc]

### Parts
IC33  XCKU040-1FFVA1156C  [BGA1156C100P34X34_3500X3500X350]  (parts T,U,V of 22)

### Nets
GND: IC33.A1(GND) IC33.A2(GND) IC33.A5(GND) IC33.A6(GND) IC33.A7(GND) IC33.A11(GND) IC33.A21(GND) IC33.A30(GND) IC33.A31(GND) IC33.A32(GND) IC33.AA1(GND) IC33.AA2(GND) IC33.AA5(GND) IC33.AA11(GND) IC33.AA13(GND) IC33.AA15(GND) IC33.AA17(GND) IC33.AA19(GND) IC33.AA21(GND) IC33.AA31(GND) IC33.AB3(GND) IC33.AB4(GND) IC33.AB8(GND) IC33.AB10(GND) IC33.AB12(GND) IC33.AB14(GND) IC33.AB16(GND) IC33.AB18(GND) IC33.AB28(GND) IC33.AC1(GND) IC33.AC5(GND) IC33.AC11(GND) IC33.AC13(GND) IC33.AC15(GND) IC33.AC17(GND) IC33.AC19(GND) IC33.AC25(GND) IC33.AD4(GND) IC33.AD12(GND) IC33.AD22(GND) IC33.AD32(GND) IC33.AE1(GND) IC33.AE2(GND) IC33.AE5(GND) IC33.AE7(GND) IC33.AE9(GND) IC33.AE19(GND) IC33.AE29(GND) IC33.AF3(GND) IC33.AF4(GND) IC33.AF7(GND) IC33.AF16(GND) IC33.AF26(GND) IC33.AG1(GND) IC33.AG5(GND) IC33.AG7(GND) IC33.AG13(GND) IC33.AG23(GND) IC33.AG33(GND) IC33.AH4(GND) IC33.AH7(GND) IC33.AH10(GND) IC33.AH20(GND) IC33.AH30(GND) IC33.AJ1(GND) IC33.AJ2(GND) IC33.AJ5(GND) IC33.AJ7(GND) IC33.AJ17(GND) IC33.AJ27(GND) IC33.AK3(GND) IC33.AK4(GND) IC33.AK7(GND) IC33.AK14(GND) IC33.AK24(GND) IC33.AK34(GND) IC33.AL1(GND) IC33.AL5(GND) IC33.AL7(GND) IC33.AL11(GND) IC33.AL21(GND) IC33.AL31(GND) IC33.AM4(GND) IC33.AM7(GND) IC33.AM8(GND) IC33.AM18(GND) IC33.AM28(GND) IC33.AN1(GND) IC33.AN2(GND) IC33.AN5(GND) IC33.AN7(GND) IC33.AN15(GND) IC33.AN25(GND) IC33.AP3(GND) IC33.AP4(GND) IC33.AP7(GND) IC33.AP12(GND) IC33.AP22(GND) IC33.AP32(GND) IC33.B3(GND) IC33.B4(GND) IC33.B7(GND) IC33.B8(GND) IC33.B18(GND) IC33.B28(GND) IC33.B30(GND) IC33.B33(GND) IC33.B34(GND) IC33.C1(GND) IC33.C5(GND) IC33.C7(GND) IC33.C15(GND) IC33.C25(GND) IC33.C30(GND) IC33.C31(GND) IC33.D4(GND) IC33.D7(GND) IC33.D12(GND) IC33.D22(GND) IC33.D30(GND) IC33.D34(GND) IC33.E1(GND) IC33.E2(GND) IC33.E5(GND) IC33.E7(GND) IC33.E9(GND) IC33.E19(GND) IC33.E29(GND) IC33.E30(GND) IC33.E32(GND) IC33.F3(GND) IC33.F4(GND) IC33.F7(GND) IC33.F16(GND) IC33.F26(GND) IC33.F28(GND) IC33.F29(GND) IC33.F33(GND) IC33.F34(GND) IC33.G1(GND) IC33.G5(GND) IC33.G7(GND) IC33.G13(GND) IC33.G23(GND) IC33.G28(GND) IC33.G31(GND) IC33.H4(GND) IC33.H7(GND) IC33.H10(GND) IC33.H20(GND) IC33.H28(GND) IC33.H30(GND) IC33.H34(GND) IC33.J1(GND) IC33.J2(GND) IC33.J5(GND) IC33.J7(GND) IC33.J17(GND) IC33.J27(GND) IC33.J28(GND) IC33.J32(GND) IC33.K3(GND) IC33.K4(GND) IC33.K14(GND) IC33.K24(GND) IC33.K28(GND) IC33.K30(GND) IC33.K34(GND) IC33.L1(GND) IC33.L5(GND) IC33.L11(GND) IC33.L21(GND) IC33.L28(GND) IC33.L31(GND) IC33.M4(GND) IC33.M8(GND) IC33.M10(GND) IC33.M12(GND) IC33.M14(GND) IC33.M16(GND) IC33.M18(GND) IC33.M28(GND) IC33.M30(GND) IC33.M33(GND) IC33.M34(GND) IC33.N1(GND) IC33.N2(GND) IC33.N5(GND) IC33.N9(GND) IC33.N11(GND) IC33.N13(GND) IC33.N15(GND) IC33.N17(GND) IC33.N19(GND) IC33.N25(GND) IC33.N28(GND) IC33.N32(GND) IC33.P3(GND) IC33.P4(GND) IC33.P8(GND) IC33.P10(GND) IC33.P12(GND) IC33.P14(GND) IC33.P16(GND) IC33.P18(GND) IC33.P22(GND) IC33.P28(GND) IC33.P30(GND) IC33.P34(GND) IC33.R1(GND) IC33.R5(GND) IC33.R9(GND) IC33.R11(GND) IC33.R13(GND) IC33.R15(GND) IC33.R17(GND) IC33.R19(GND) IC33.R28(GND) IC33.R31(GND) IC33.T4(GND) IC33.T8(GND) IC33.T10(GND) IC33.T12(GND) IC33.T14(GND) IC33.T16(GND) IC33.T18(GND) IC33.T20(GND) IC33.T26(GND) IC33.T28(GND) IC33.T29(GND) IC33.T30(GND) IC33.T33(GND) IC33.T34(GND) IC33.U1(GND) IC33.U2(GND) IC33.U5(GND) IC33.U11(GNDADC) IC33.U13(GND) IC33.U15(GND) IC33.U17(GND) IC33.U19(GND) IC33.U23(GND) IC33.U30(GND) IC33.U31(GND) IC33.U32(GND) IC33.U33(GND) IC33.V3(GND) IC33.V4(GND) IC33.V8(GND) IC33.V10(GND) IC33.V14(GND) IC33.V16(GND) IC33.V18(GND) IC33.V20(GND) IC33.V30(GND) IC33.W1(GND) IC33.W5(GND) IC33.W13(GND) IC33.W15(GND) IC33.W17(GND) IC33.W19(GND) IC33.W27(GND) IC33.Y4(GND) IC33.Y8(GND) IC33.Y10(GND) IC33.Y14(GND) IC33.Y16(GND) IC33.Y18(GND) IC33.Y20(GND) IC33.Y24(GND) IC33.Y34(GND)

Not connected (* = marked no-connect by the designer): IC33 A33(NC) A34(NC) B31(NC) B32(NC) C33(NC) C34(NC) D31(NC) D32(NC) E33(NC) E34(NC) F31(NC) F32(NC) G29(NC) G30(NC) G33(NC) G34(NC) H31(NC) H32(NC) J29(NC) J30(NC) J33(NC) J34(NC) K31(NC) K32(NC) L29(NC) L30(NC) L33(NC) L34(NC) M31(NC) M32(NC) N29(NC) N30(NC) N33(NC) N34(NC) P31(NC) P32(NC) R29(NC) R30(NC) R33(NC) R34(NC) T31(NC) T32(NC)

### Notes on the sheet
- Project/Equipment
- Document
- Designer
- Drawn by
- Check.by
- Copyright WUT ISE 2018.
  This documentation describes Open Hardware and is licensed under the CERN OHL v.1.1. You may redistribute and modify this documentation under the terms of the CERN OHL v.1.1. (http://ohwr.org/CERNOHL). This documentation is distributed WITHOUT ANY EXPRESS OR IMPLIED WARRANTY, INCLUDING OF MERCHANTABILITY, SATISFACTORY QUALITY AND FITNESS FOR A PARTICULAR PURPOSE. Please see the CERN OHL v.1.1 for applicable conditions.
- Contact
- File
- Last Mod.
- Print Date
- Sheet
- Size
- A3
- of
- Rev

### Library data of the parts
IC33 = XCKU040-1FFVA1156C: as IC33 on sheet MCH_FPGA_Banks_66_68_HP_FMC; Manufacturer Part Number: XCKU040-1FFVA1156C; PackageDescription: BGA, 1.00mm Pitch, Square; 1156 Pin, 34 Columns X 34 Rows, Body 35.00mm X 35.00mm X 3.50mm H, IPC Medium Density; Part Number: XCKU040-1FFVA1156C; Component Kind: Standard; Component Type: Standard; Device: XCKU040-1FFVA1156C; Pin Count: 1156; Case: BGA1156; Mounted: Yes; Socket: No; SMD: Yes; Sense: No; ComponentHeight: 3.5mm; HelpURL: \\cern.ch\dfs\Applications\Altium\Datasheets\XCKU040-1FFVA1156C.pdf; ComponentLink1URL: \\cern.ch\dfs\Applications\Altium\Datasheets\XCKU040-1FFVA1156C_Package-Pinout.pdf; ComponentLink1Description: Package/Pinout; Author: CERN DEM CA; CreateDate: 16.08.2016; LatestRevisionDate: 16.08.2016

## Sheet MCH_FPGA_Decoupling.SchDoc: Metlino
size 420 x 297 mm; CheckedBy: P.Kulik,T.Przywozki,W.Ruclo; Author: G.Kasprowicz; CompanyName: WUT ISE; DrawnBy: G.Kasprowicz; Organization: WUT ISE; Address1: PW ISE; Address2: Nowowiejska 15/19 00-665 Warsaw; Address3: gkasprow@gmail.com; DocumentNumber: 11; Revision: 2; SheetNumber: 11; SheetTotal: 29; ModifiedBy: -; CheckedDate: -; Title2: FPGA decoupling; DivGrp: WUT ISE; Designer: G.Kasprowicz; ModifiedDate: -; ProjectName: Sensor Box
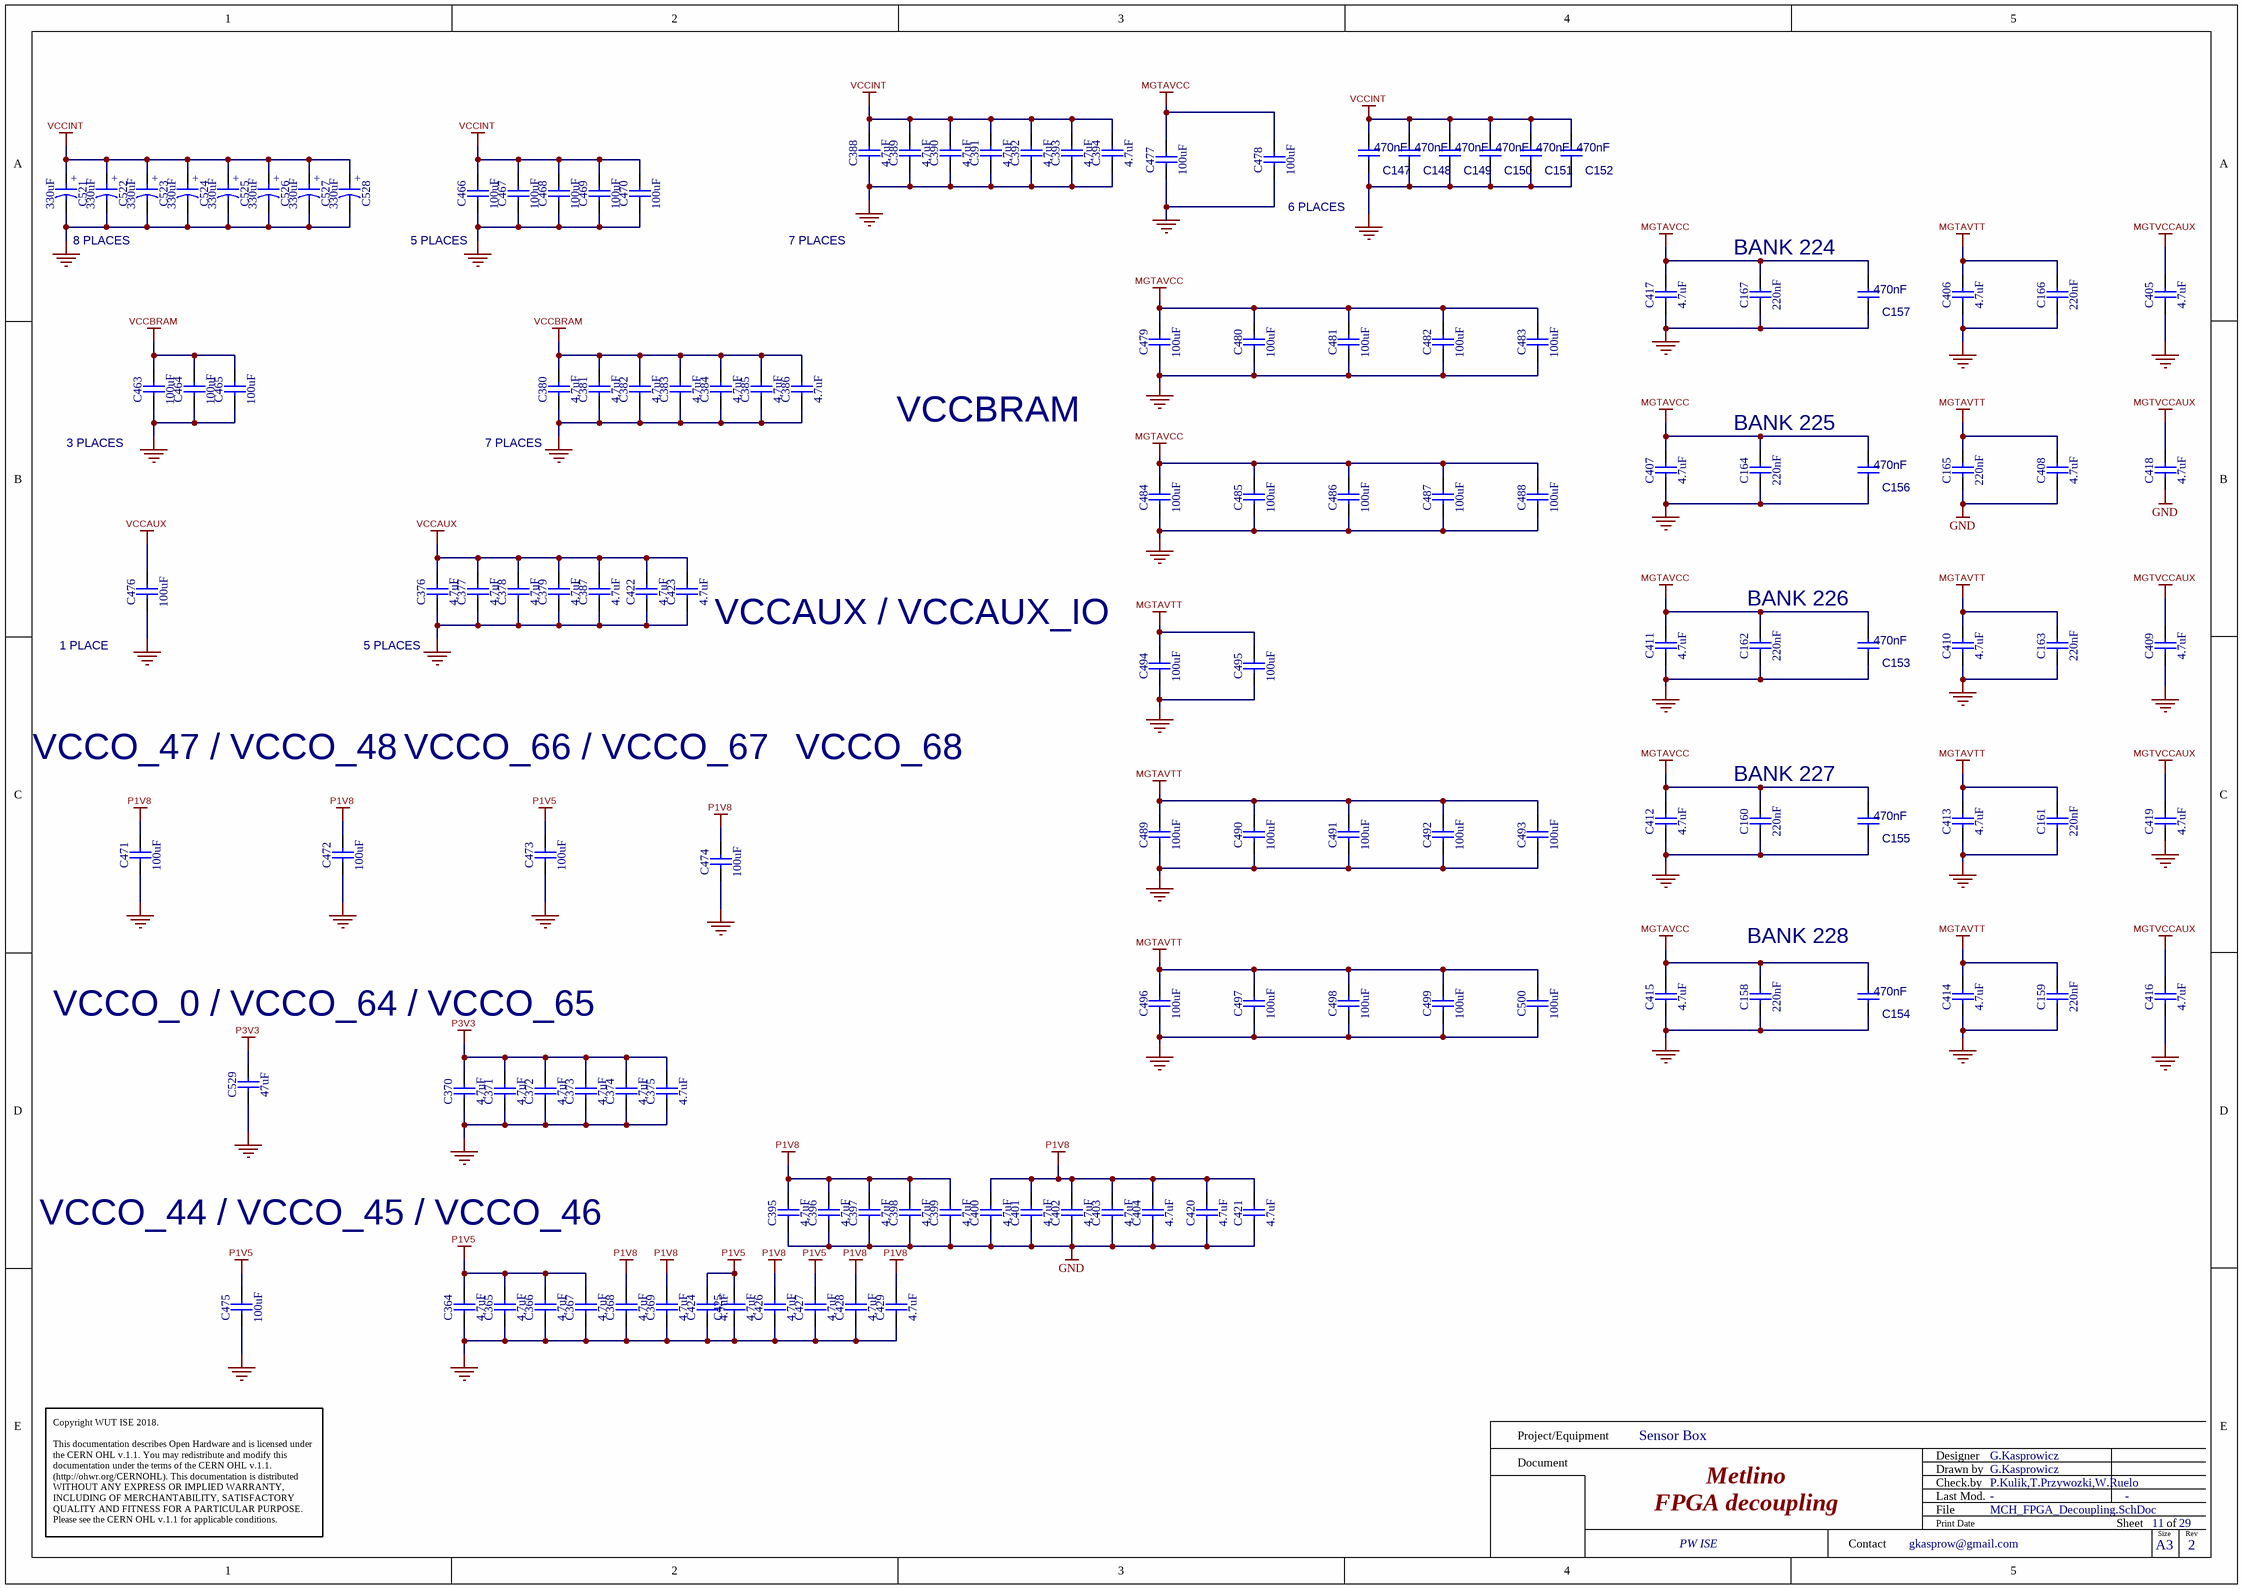
[diagram p28: MCH_FPGA_Decoupling.SchDoc]

### Parts
C147  470nF  [CAPC0603X33N]
C148  470nF  [CAPC0603X33N]
C149  470nF  [CAPC0603X33N]
C150  470nF  [CAPC0603X33N]
C151  470nF  [CAPC0603X33N]
C152  470nF  [CAPC0603X33N]
C153  470nF  [CAPC0603X33N]
C154  470nF  [CAPC0603X33N]
C155  470nF  [CAPC0603X33N]
C156  470nF  [CAPC0603X33N]
C157  470nF  [CAPC0603X33N]
C158  220nF  [CAPC0603X33N]
C159  220nF  [CAPC0603X33N]
C160  220nF  [CAPC0603X33N]
C161  220nF  [CAPC0603X33N]
C162  220nF  [CAPC0603X33N]
C163  220nF  [CAPC0603X33N]
C164  220nF  [CAPC0603X33N]
C165  220nF  [CAPC0603X33N]
C166  220nF  [CAPC0603X33N]
C167  220nF  [CAPC0603X33N]
C364  4.7uF  [CAPC1005X55N]
C365  4.7uF  [CAPC1005X55N]
C366  4.7uF  [CAPC1005X55N]
C367  4.7uF  [CAPC1005X55N]
C368  4.7uF  [CAPC1005X55N]
C369  4.7uF  [CAPC1005X55N]
C370  4.7uF  [CAPC1005X55N]
C371  4.7uF  [CAPC1005X55N]
C372  4.7uF  [CAPC1005X55N]
C373  4.7uF  [CAPC1005X55N]
C374  4.7uF  [CAPC1005X55N]
C375  4.7uF  [CAPC1005X55N]
C376  4.7uF  [CAPC1005X55N]
C377  4.7uF  [CAPC1005X55N]
C378  4.7uF  [CAPC1005X55N]
C379  4.7uF  [CAPC1005X55N]
C380  4.7uF  [CAPC1005X55N]
C381  4.7uF  [CAPC1005X55N]
C382  4.7uF  [CAPC1005X55N]
C383  4.7uF  [CAPC1005X55N]
C384  4.7uF  [CAPC1005X55N]
C385  4.7uF  [CAPC1005X55N]
C386  4.7uF  [CAPC1005X55N]
C387  4.7uF  [CAPC1005X55N]
C388  4.7uF  [CAPC1005X55N]
C389  4.7uF  [CAPC1005X55N]
C390  4.7uF  [CAPC1005X55N]
C391  4.7uF  [CAPC1005X55N]
C392  4.7uF  [CAPC1005X55N]
C393  4.7uF  [CAPC1005X55N]
C394  4.7uF  [CAPC1005X55N]
C395  4.7uF  [CAPC1005X55N]
C396  4.7uF  [CAPC1005X55N]
C397  4.7uF  [CAPC1005X55N]
C398  4.7uF  [CAPC1005X55N]
C399  4.7uF  [CAPC1005X55N]
C400  4.7uF  [CAPC1005X55N]
C401  4.7uF  [CAPC1005X55N]
C402  4.7uF  [CAPC1005X55N]
C403  4.7uF  [CAPC1005X55N]
C404  4.7uF  [CAPC1005X55N]
C405  4.7uF  [CAPC1005X55N]
C406  4.7uF  [CAPC1005X55N]
C407  4.7uF  [CAPC1005X55N]
C408  4.7uF  [CAPC1005X55N]
C409  4.7uF  [CAPC1005X55N]
C410  4.7uF  [CAPC1005X55N]
C411  4.7uF  [CAPC1005X55N]
C412  4.7uF  [CAPC1005X55N]
C413  4.7uF  [CAPC1005X55N]
C414  4.7uF  [CAPC1005X55N]
C415  4.7uF  [CAPC1005X55N]
C416  4.7uF  [CAPC1005X55N]
C417  4.7uF  [CAPC1005X55N]
C418  4.7uF  [CAPC1005X55N]
C419  4.7uF  [CAPC1005X55N]
C420  4.7uF  [CAPC1005X55N]
C421  4.7uF  [CAPC1005X55N]
C422  4.7uF  [CAPC1005X55N]
C423  4.7uF  [CAPC1005X55N]
C424  4.7uF  [CAPC1005X55N]
C425  4.7uF  [CAPC1005X55N]
C426  4.7uF  [CAPC1005X55N]
C427  4.7uF  [CAPC1005X55N]
C428  4.7uF  [CAPC1005X55N]
C429  4.7uF  [CAPC1005X55N]
C463  100uF  [CAPC3216X180N]
C464  100uF  [CAPC3216X180N]
C465  100uF  [CAPC3216X180N]
C466  100uF  [CAPC3216X180N]
C467  100uF  [CAPC3216X180N]
C468  100uF  [CAPC3216X180N]
C469  100uF  [CAPC3216X180N]
C470  100uF  [CAPC3216X180N]
C471  100uF  [CAPC3216X180N]
C472  100uF  [CAPC3216X180N]
C473  100uF  [CAPC3216X180N]
C474  100uF  [CAPC3216X180N]
C475  100uF  [CAPC3216X180N]
C476  100uF  [CAPC3216X180N]
C477  100uF  [CAPC3216X180N]
C478  100uF  [CAPC3216X180N]
C479  100uF  [CAPC3216X180N]
C480  100uF  [CAPC3216X180N]
C481  100uF  [CAPC3216X180N]
C482  100uF  [CAPC3216X180N]
C483  100uF  [CAPC3216X180N]
C484  100uF  [CAPC3216X180N]
C485  100uF  [CAPC3216X180N]
C486  100uF  [CAPC3216X180N]
C487  100uF  [CAPC3216X180N]
C488  100uF  [CAPC3216X180N]
C489  100uF  [CAPC3216X180N]
C490  100uF  [CAPC3216X180N]
C491  100uF  [CAPC3216X180N]
C492  100uF  [CAPC3216X180N]
C493  100uF  [CAPC3216X180N]
C494  100uF  [CAPC3216X180N]
C495  100uF  [CAPC3216X180N]
C496  100uF  [CAPC3216X180N]
C497  100uF  [CAPC3216X180N]
C498  100uF  [CAPC3216X180N]
C499  100uF  [CAPC3216X180N]
C500  100uF  [CAPC3216X180N]
C521  330uF  [CAPMP3528X210N]
C522  330uF  [CAPMP3528X210N]
C523  330uF  [CAPMP3528X210N]
C524  330uF  [CAPMP3528X210N]
C525  330uF  [CAPMP3528X210N]
C526  330uF  [CAPMP3528X210N]
C527  330uF  [CAPMP3528X210N]
C528  330uF  [CAPMP3528X210N]
C529  47uF  [CAPC3225X270N]

### Nets
GND: C147.1 C148.1 C149.1 C150.1 C151.1 C152.1 C153.1 C154.1 C155.1 C156.1 C157.1 C158.1 C159.1 C160.1 C161.1 C162.1 C163.1 C164.1 C165.1 C166.1 C167.1 C364.1 C365.1 C366.1 C367.1 C368.1 C369.1 C370.1 C371.1 C372.1 C373.1 C374.1 C375.1 C376.1 C377.1 C378.1 C379.1 C380.1 C381.1 C382.1 C383.1 C384.1 C385.1 C386.1 C387.1 C388.1 C389.1 C390.1 C391.1 C392.1 C393.1 C394.1 C395.1 C396.1 C397.1 C398.1 C399.1 C400.1 C401.1 C402.1 C403.1 C404.1 C405.1 C406.1 C407.1 C408.1 C409.1 C410.1 C411.1 C412.1 C413.1 C414.1 C415.1 C416.1 C417.1 C418.1 C419.1 C420.1 C421.1 C422.1 C423.1 C424.1 C425.1 C426.1 C427.1 C428.1 C429.1 C463.1 C464.1 C465.1 C466.1 C467.1 C468.1 C469.1 C470.1 C471.1 C472.1 C473.1 C474.1 C475.1 C476.1 C477.1 C478.1 C479.1 C480.1 C481.1 C482.1 C483.1 C484.1 C485.1 C486.1 C487.1 C488.1 C489.1 C490.1 C491.1 C492.1 C493.1 C494.1 C495.1 C496.1 C497.1 C498.1 C499.1 C500.1 C521.2 C522.2 C523.2 C524.2 C525.2 C526.2 C527.2 C528.2 C529.1
MGTAVCC: C153.2 C154.2 C155.2 C156.2 C157.2 C158.2 C160.2 C162.2 C164.2 C167.2 C407.2 C411.2 C412.2 C415.2 C417.2 C477.2 C478.2 C479.2 C480.2 C481.2 C482.2 C483.2 C484.2 C485.2 C486.2 C487.2 C488.2
MGTAVTT: C159.2 C161.2 C163.2 C165.2 C166.2 C406.2 C408.2 C410.2 C413.2 C414.2 C489.2 C490.2 C491.2 C492.2 C493.2 C494.2 C495.2 C496.2 C497.2 C498.2 C499.2 C500.2
MGTVCCAUX: C405.2 C409.2 C416.2 C418.2 C419.2
P1V5: C364.2 C365.2 C366.2 C367.2 C424.2 C425.2 C427.2 C473.2 C475.2
P1V8: C368.2 C369.2 C395.2 C396.2 C397.2 C398.2 C399.2 C400.2 C401.2 C402.2 C403.2 C404.2 C420.2 C421.2 C426.2 C428.2 C429.2 C471.2 C472.2 C474.2
P3V3: C370.2 C371.2 C372.2 C373.2 C374.2 C375.2 C529.2
VCCAUX: C376.2 C377.2 C378.2 C379.2 C387.2 C422.2 C423.2 C476.2
VCCBRAM: C380.2 C381.2 C382.2 C383.2 C384.2 C385.2 C386.2 C463.2 C464.2 C465.2
VCCINT: C147.2 C148.2 C149.2 C150.2 C151.2 C152.2 C388.2 C389.2 C390.2 C391.2 C392.2 C393.2 C394.2 C466.2 C467.2 C468.2 C469.2 C470.2 C521.1 C522.1 C523.1 C524.1 C525.1 C526.1 C527.1 C528.1

### Notes on the sheet
- 8 PLACES
- (near C466) 5 PLACES
- 7 PLACES
- 6 PLACES
- (near C167) BANK 224
- 3 PLACES
- (near C380) 7 PLACES
- VCCBRAM
- (near C164) BANK 225
- BANK 226
- 1 PLACE
- (near C376) 5 PLACES
- (near C423) VCCAUX / VCCAUX_IO
- VCCO_47 / VCCO_48
- VCCO_66 / VCCO_67
- VCCO_68
- (near C160) BANK 227
- BANK 228
- VCCO_0 / VCCO_64 / VCCO_65
- VCCO_44 / VCCO_45 / VCCO_46
- Project/Equipment
- Document
- Designer
- Drawn by
- Check.by
- Copyright WUT ISE 2018.
  This documentation describes Open Hardware and is licensed under the CERN OHL v.1.1. You may redistribute and modify this documentation under the terms of the CERN OHL v.1.1. (http://ohwr.org/CERNOHL). This documentation is distributed WITHOUT ANY EXPRESS OR IMPLIED WARRANTY, INCLUDING OF MERCHANTABILITY, SATISFACTORY QUALITY AND FITNESS FOR A PARTICULAR PURPOSE. Please see the CERN OHL v.1.1 for applicable conditions.
- Contact
- File
- Last Mod.
- Print Date
- Sheet
- Size
- A3
- of
- Rev
- (in symbol CTE3528-21_330UF_2.5V_20%_LESR0015_KEMET_T520) +

### Library data of the parts
C147 = CAPC0603X33N: $$NotCommonProperty_General Part Number: CC0201_470NF_4V_20%_X5R; $$NotCommonProperty_Manufacturer1 Example: TAIYO YUDEN; $$NotCommonProperty_Manufacturer1 Part Number: AMK063BJ474MP-F; Manufacturer: GENERIC; Part Description: SMD Multilayer Chip Ceramic Capacitor; Part Name: Capacitor - non polarized CAPC0603X33N; $$Internal_Resolution: 00001mm; $$NotCommonProperty_Case: 0201; $$NotCommonProperty_Pin Count: 2; $$NotCommonProperty_SMD: Yes; $$NotCommonProperty_Status: Not Recommended; $$NotCommonProperty_TC: X5R; $$NotCommonProperty_Voltage: 4V; CmpIndex: 875; DXDB_LIBNAME: Capacitors SMD; Ref Designator: C147; SymIndex: 331; Tolerance: ±20%; Cell Name: CAPC0603X33N; Manufacturer Part Number: CC0201_470NF_4V_20%_X5R; Part Number: Capacitor - non polarized CAPC0603X33N; Value: 470nF; Orientation: 1 = 1
C148 = CAPC0603X33N: $$NotCommonProperty_General Part Number: CC0201_470NF_4V_20%_X5R; $$NotCommonProperty_Manufacturer1 Example: TAIYO YUDEN; $$NotCommonProperty_Manufacturer1 Part Number: AMK063BJ474MP-F; Manufacturer: GENERIC; Part Description: SMD Multilayer Chip Ceramic Capacitor; Part Name: Capacitor - non polarized CAPC0603X33N; $$Internal_Resolution: 00001mm; $$NotCommonProperty_Case: 0201; $$NotCommonProperty_Pin Count: 2; $$NotCommonProperty_SMD: Yes; $$NotCommonProperty_Status: Not Recommended; $$NotCommonProperty_TC: X5R; $$NotCommonProperty_Voltage: 4V; CmpIndex: 896; DXDB_LIBNAME: Capacitors SMD; Ref Designator: C148; SymIndex: 331; Tolerance: ±20%; Cell Name: CAPC0603X33N; Manufacturer Part Number: CC0201_470NF_4V_20%_X5R; Part Number: Capacitor - non polarized CAPC0603X33N; Value: 470nF; Orientation: 1 = 1
C149 = CAPC0603X33N: $$NotCommonProperty_General Part Number: CC0201_470NF_4V_20%_X5R; $$NotCommonProperty_Manufacturer1 Example: TAIYO YUDEN; $$NotCommonProperty_Manufacturer1 Part Number: AMK063BJ474MP-F; Manufacturer: GENERIC; Part Description: SMD Multilayer Chip Ceramic Capacitor; Part Name: Capacitor - non polarized CAPC0603X33N; $$Internal_Resolution: 00001mm; $$NotCommonProperty_Case: 0201; $$NotCommonProperty_Pin Count: 2; $$NotCommonProperty_SMD: Yes; $$NotCommonProperty_Status: Not Recommended; $$NotCommonProperty_TC: X5R; $$NotCommonProperty_Voltage: 4V; CmpIndex: 1012; DXDB_LIBNAME: Capacitors SMD; Ref Designator: C149; SymIndex: 331; Tolerance: ±20%; Cell Name: CAPC0603X33N; Manufacturer Part Number: CC0201_470NF_4V_20%_X5R; Part Number: Capacitor - non polarized CAPC0603X33N; Value: 470nF; Orientation: 1 = 1
C150 = CAPC0603X33N: $$NotCommonProperty_General Part Number: CC0201_470NF_4V_20%_X5R; $$NotCommonProperty_Manufacturer1 Example: TAIYO YUDEN; $$NotCommonProperty_Manufacturer1 Part Number: AMK063BJ474MP-F; Manufacturer: GENERIC; Part Description: SMD Multilayer Chip Ceramic Capacitor; Part Name: Capacitor - non polarized CAPC0603X33N; $$Internal_Resolution: 00001mm; $$NotCommonProperty_Case: 0201; $$NotCommonProperty_Pin Count: 2; $$NotCommonProperty_SMD: Yes; $$NotCommonProperty_Status: Not Recommended; $$NotCommonProperty_TC: X5R; $$NotCommonProperty_Voltage: 4V; CmpIndex: 1016; DXDB_LIBNAME: Capacitors SMD; Ref Designator: C150; SymIndex: 331; Tolerance: ±20%; Cell Name: CAPC0603X33N; Manufacturer Part Number: CC0201_470NF_4V_20%_X5R; Part Number: Capacitor - non polarized CAPC0603X33N; Value: 470nF; Orientation: 1 = 1
C151 = CAPC0603X33N: $$NotCommonProperty_General Part Number: CC0201_470NF_4V_20%_X5R; $$NotCommonProperty_Manufacturer1 Example: TAIYO YUDEN; $$NotCommonProperty_Manufacturer1 Part Number: AMK063BJ474MP-F; Manufacturer: GENERIC; Part Description: SMD Multilayer Chip Ceramic Capacitor; Part Name: Capacitor - non polarized CAPC0603X33N; $$Internal_Resolution: 00001mm; $$NotCommonProperty_Case: 0201; $$NotCommonProperty_Pin Count: 2; $$NotCommonProperty_SMD: Yes; $$NotCommonProperty_Status: Not Recommended; $$NotCommonProperty_TC: X5R; $$NotCommonProperty_Voltage: 4V; CmpIndex: 916; DXDB_LIBNAME: Capacitors SMD; Ref Designator: C151; SymIndex: 331; Tolerance: ±20%; Cell Name: CAPC0603X33N; Manufacturer Part Number: CC0201_470NF_4V_20%_X5R; Part Number: Capacitor - non polarized CAPC0603X33N; Value: 470nF; Orientation: 1 = 1
C152 = CAPC0603X33N: $$NotCommonProperty_General Part Number: CC0201_470NF_4V_20%_X5R; $$NotCommonProperty_Manufacturer1 Example: TAIYO YUDEN; $$NotCommonProperty_Manufacturer1 Part Number: AMK063BJ474MP-F; Manufacturer: GENERIC; Part Description: SMD Multilayer Chip Ceramic Capacitor; Part Name: Capacitor - non polarized CAPC0603X33N; $$Internal_Resolution: 00001mm; $$NotCommonProperty_Case: 0201; $$NotCommonProperty_Pin Count: 2; $$NotCommonProperty_SMD: Yes; $$NotCommonProperty_Status: Not Recommended; $$NotCommonProperty_TC: X5R; $$NotCommonProperty_Voltage: 4V; CmpIndex: 993; DXDB_LIBNAME: Capacitors SMD; Ref Designator: C152; SymIndex: 331; Tolerance: ±20%; Cell Name: CAPC0603X33N; Manufacturer Part Number: CC0201_470NF_4V_20%_X5R; Part Number: Capacitor - non polarized CAPC0603X33N; Value: 470nF; Orientation: 1 = 1
C153 = CAPC0603X33N: $$NotCommonProperty_General Part Number: CC0201_470NF_4V_20%_X5R; $$NotCommonProperty_Manufacturer1 Example: TAIYO YUDEN; $$NotCommonProperty_Manufacturer1 Part Number: AMK063BJ474MP-F; Manufacturer: GENERIC; Part Description: SMD Multilayer Chip Ceramic Capacitor; Part Name: Capacitor - non polarized CAPC0603X33N; $$Internal_Resolution: 00001mm; $$NotCommonProperty_Case: 0201; $$NotCommonProperty_Pin Count: 2; $$NotCommonProperty_SMD: Yes; $$NotCommonProperty_Status: Not Recommended; $$NotCommonProperty_TC: X5R; $$NotCommonProperty_Voltage: 4V; CmpIndex: 1018; DXDB_LIBNAME: Capacitors SMD; Ref Designator: C153; SymIndex: 331; Tolerance: ±20%; Cell Name: CAPC0603X33N; Manufacturer Part Number: CC0201_470NF_4V_20%_X5R; Part Number: Capacitor - non polarized CAPC0603X33N; Value: 470nF; Orientation: 1 = 1
C154 = CAPC0603X33N: $$NotCommonProperty_General Part Number: CC0201_470NF_4V_20%_X5R; $$NotCommonProperty_Manufacturer1 Example: TAIYO YUDEN; $$NotCommonProperty_Manufacturer1 Part Number: AMK063BJ474MP-F; Manufacturer: GENERIC; Part Description: SMD Multilayer Chip Ceramic Capacitor; Part Name: Capacitor - non polarized CAPC0603X33N; $$Internal_Resolution: 00001mm; $$NotCommonProperty_Case: 0201; $$NotCommonProperty_Pin Count: 2; $$NotCommonProperty_SMD: Yes; $$NotCommonProperty_Status: Not Recommended; $$NotCommonProperty_TC: X5R; $$NotCommonProperty_Voltage: 4V; CmpIndex: 855; DXDB_LIBNAME: Capacitors SMD; Ref Designator: C154; SymIndex: 331; Tolerance: ±20%; Cell Name: CAPC0603X33N; Manufacturer Part Number: CC0201_470NF_4V_20%_X5R; Part Number: Capacitor - non polarized CAPC0603X33N; Value: 470nF; Orientation: 1 = 1
C155 = CAPC0603X33N: $$NotCommonProperty_General Part Number: CC0201_470NF_4V_20%_X5R; $$NotCommonProperty_Manufacturer1 Example: TAIYO YUDEN; $$NotCommonProperty_Manufacturer1 Part Number: AMK063BJ474MP-F; Manufacturer: GENERIC; Part Description: SMD Multilayer Chip Ceramic Capacitor; Part Name: Capacitor - non polarized CAPC0603X33N; $$Internal_Resolution: 00001mm; $$NotCommonProperty_Case: 0201; $$NotCommonProperty_Pin Count: 2; $$NotCommonProperty_SMD: Yes; $$NotCommonProperty_Status: Not Recommended; $$NotCommonProperty_TC: X5R; $$NotCommonProperty_Voltage: 4V; CmpIndex: 975; DXDB_LIBNAME: Capacitors SMD; Ref Designator: C155; SymIndex: 331; Tolerance: ±20%; Cell Name: CAPC0603X33N; Manufacturer Part Number: CC0201_470NF_4V_20%_X5R; Part Number: Capacitor - non polarized CAPC0603X33N; Value: 470nF; Orientation: 1 = 1
C156 = CAPC0603X33N: $$NotCommonProperty_General Part Number: CC0201_470NF_4V_20%_X5R; $$NotCommonProperty_Manufacturer1 Example: TAIYO YUDEN; $$NotCommonProperty_Manufacturer1 Part Number: AMK063BJ474MP-F; Manufacturer: GENERIC; Part Description: SMD Multilayer Chip Ceramic Capacitor; Part Name: Capacitor - non polarized CAPC0603X33N; $$Internal_Resolution: 00001mm; $$NotCommonProperty_Case: 0201; $$NotCommonProperty_Pin Count: 2; $$NotCommonProperty_SMD: Yes; $$NotCommonProperty_Status: Not Recommended; $$NotCommonProperty_TC: X5R; $$NotCommonProperty_Voltage: 4V; CmpIndex: 865; DXDB_LIBNAME: Capacitors SMD; Ref Designator: C156; SymIndex: 331; Tolerance: ±20%; Cell Name: CAPC0603X33N; Manufacturer Part Number: CC0201_470NF_4V_20%_X5R; Part Number: Capacitor - non polarized CAPC0603X33N; Value: 470nF; Orientation: 1 = 1
C157 = CAPC0603X33N: $$NotCommonProperty_General Part Number: CC0201_470NF_4V_20%_X5R; $$NotCommonProperty_Manufacturer1 Example: TAIYO YUDEN; $$NotCommonProperty_Manufacturer1 Part Number: AMK063BJ474MP-F; Manufacturer: GENERIC; Part Description: SMD Multilayer Chip Ceramic Capacitor; Part Name: Capacitor - non polarized CAPC0603X33N; $$Internal_Resolution: 00001mm; $$NotCommonProperty_Case: 0201; $$NotCommonProperty_Pin Count: 2; $$NotCommonProperty_SMD: Yes; $$NotCommonProperty_Status: Not Recommended; $$NotCommonProperty_TC: X5R; $$NotCommonProperty_Voltage: 4V; CmpIndex: 944; DXDB_LIBNAME: Capacitors SMD; Ref Designator: C157; SymIndex: 331; Tolerance: ±20%; Cell Name: CAPC0603X33N; Manufacturer Part Number: CC0201_470NF_4V_20%_X5R; Part Number: Capacitor - non polarized CAPC0603X33N; Value: 470nF; Orientation: 1 = 1
C158-C167 = CC0201_220NF_6.3V_20%_X5R: Non-polarised capacitor; Manufacturer: GENERIC; Part Description: SMD Multilayer Chip Ceramic Capacitor; Manufacturer1 Part Number: JMK063BJ224MP-F; Tolerance: ±20%; Voltage: 6.3V; TC: X5R; Manufacturer Part Number: CC0201_220NF_6.3V_20%_X5R; Part Number: CC0201_220NF_6.3V_20%_X5R; Value: 220nF; Component Kind: Standard; Component Type: Standard; Pin Count: 2; Status: Not Recommended; Case: 0201; Mounted: Yes; Socket: No; SMD: Yes; Sense: No; Manufacturer1 Example: TAIYO YUDEN; Manufacturer1 ComponentHeight: 0.33mm; HelpURL: \\cern.ch\dfs\Applications\Altium\Datasheets\CC0201_X5R_TAIYO-YUDEN_STANDARD-CLASS2.pdf; Author: CERN DEM JLC; CreateDate: 27.05.2010; LatestRevisionDate: 27.05.2010
C364-C429 = CC0402_4.7UF_6.3V_20%_X5R: Non-polarised capacitor; Manufacturer: GENERIC; Part Description: SMD Multilayer Chip Ceramic Capacitor; Manufacturer1 Part Number: C1005X5R0J475M050BC; Tolerance: ±20%; Voltage: 6.3V; TC: X5R; Manufacturer Part Number: CC0402_4.7UF_6.3V_20%_X5R; Part Number: CC0402_4.7UF_6.3V_20%_X5R; Value: 4.7uF; Component Kind: Standard; Component Type: Standard; Pin Count: 2; Status: Preferred; Case: 0402; Mounted: Yes; Socket: No; SMD: Yes; Sense: No; Manufacturer1 Example: TDK; Manufacturer1 ComponentHeight: 0.65mm; HelpURL: \\cern.ch\dfs\Applications\Altium\Datasheets\CC0402_X5R_TDK_C.pdf; Author: CERN DEM JLC; CreateDate: 03.03.2015; LatestRevisionDate: 03.03.2015
C463-C500 = CC1206_100UF_6.3V_20%_X5R: Non-polarised capacitor; Manufacturer: GENERIC; Part Description: SMD Multilayer Chip Ceramic Capacitor; Manufacturer1 Part Number: C1206C107M9PACTU; Tolerance: ±10%; Voltage: 6.3V; TC: X5R; Manufacturer Part Number: CC1206_100UF_6.3V_20%_X5R; Part Number: CC1206_100UF_6.3V_20%_X5R; Value: 100uF; Component Kind: Standard; Component Type: Standard; Pin Count: 2; Status: None; Case: 1206; Mounted: Yes; Socket: No; SMD: Yes; Sense: No; Manufacturer1 Example: KEMET; Manufacturer1 ComponentHeight: 1.8mm; HelpURL: \\cern.ch\dfs\Applications\Altium\Datasheets\CC1206_X5R_KEMET.pdf; Author: CERN DEM JLC; CreateDate: 26.09.2012; LatestRevisionDate: 26.09.2012
C521-C528 = CTE3528-21_330UF_2.5V_20%_LESR0015_KEMET_T520: Polarised capacitor; Manufacturer Part Number: T520B337M2R5ATE015; Manufacturer: KEMET; Part Description: Low ESR 0R015 Tantalum Chip Capacitor; Tolerance: ±20%; Voltage: 2.5V; Part Number: CTE3528-21_330UF_2.5V_20%_LESR0015_KEMET_T520; Value: 330uF; Component Kind: Standard; Component Type: Standard; Pin Count: 2; Status: None; Case: B; Mounted: Yes; Socket: No; SMD: Yes; Sense: No; ComponentHeight: 2.1mm; HelpURL: \\cern.ch\dfs\Applications\Altium\Datasheets\CTE-LESR_KEMET_T520.pdf; Author: CERN DEM JLC; CreateDate: 07.03.2012; LatestRevisionDate: 01.09.2014
C529 = CC1210_47UF_6.3V_10%_X5R: Non-polarised capacitor; Manufacturer: GENERIC; Part Description: SMD Multilayer Chip Ceramic Capacitor; Manufacturer1 Part Number: 12106D476KAT2A; Tolerance: ±10%; Voltage: 6.3V; TC: X5R; Manufacturer Part Number: CC1210_47UF_6.3V_10%_X5R; Part Number: CC1210_47UF_6.3V_10%_X5R; Value: 47uF; Component Kind: Standard; Component Type: Standard; Pin Count: 2; Status: Preferred; Case: 1210; Mounted: Yes; Socket: No; SMD: Yes; Sense: No; Manufacturer1 Example: AVX; Manufacturer1 ComponentHeight: 2.79mm; HelpURL: \\cern.ch\dfs\Applications\Altium\Datasheets\CC1210_X5R_AVX.pdf; Author: CERN DEM JLC; CreateDate: 12.11.2014; LatestRevisionDate: 12.11.2014